# EAGLE board QuDAC_V2 (EAGLE 6.6.0), part 1 of 2
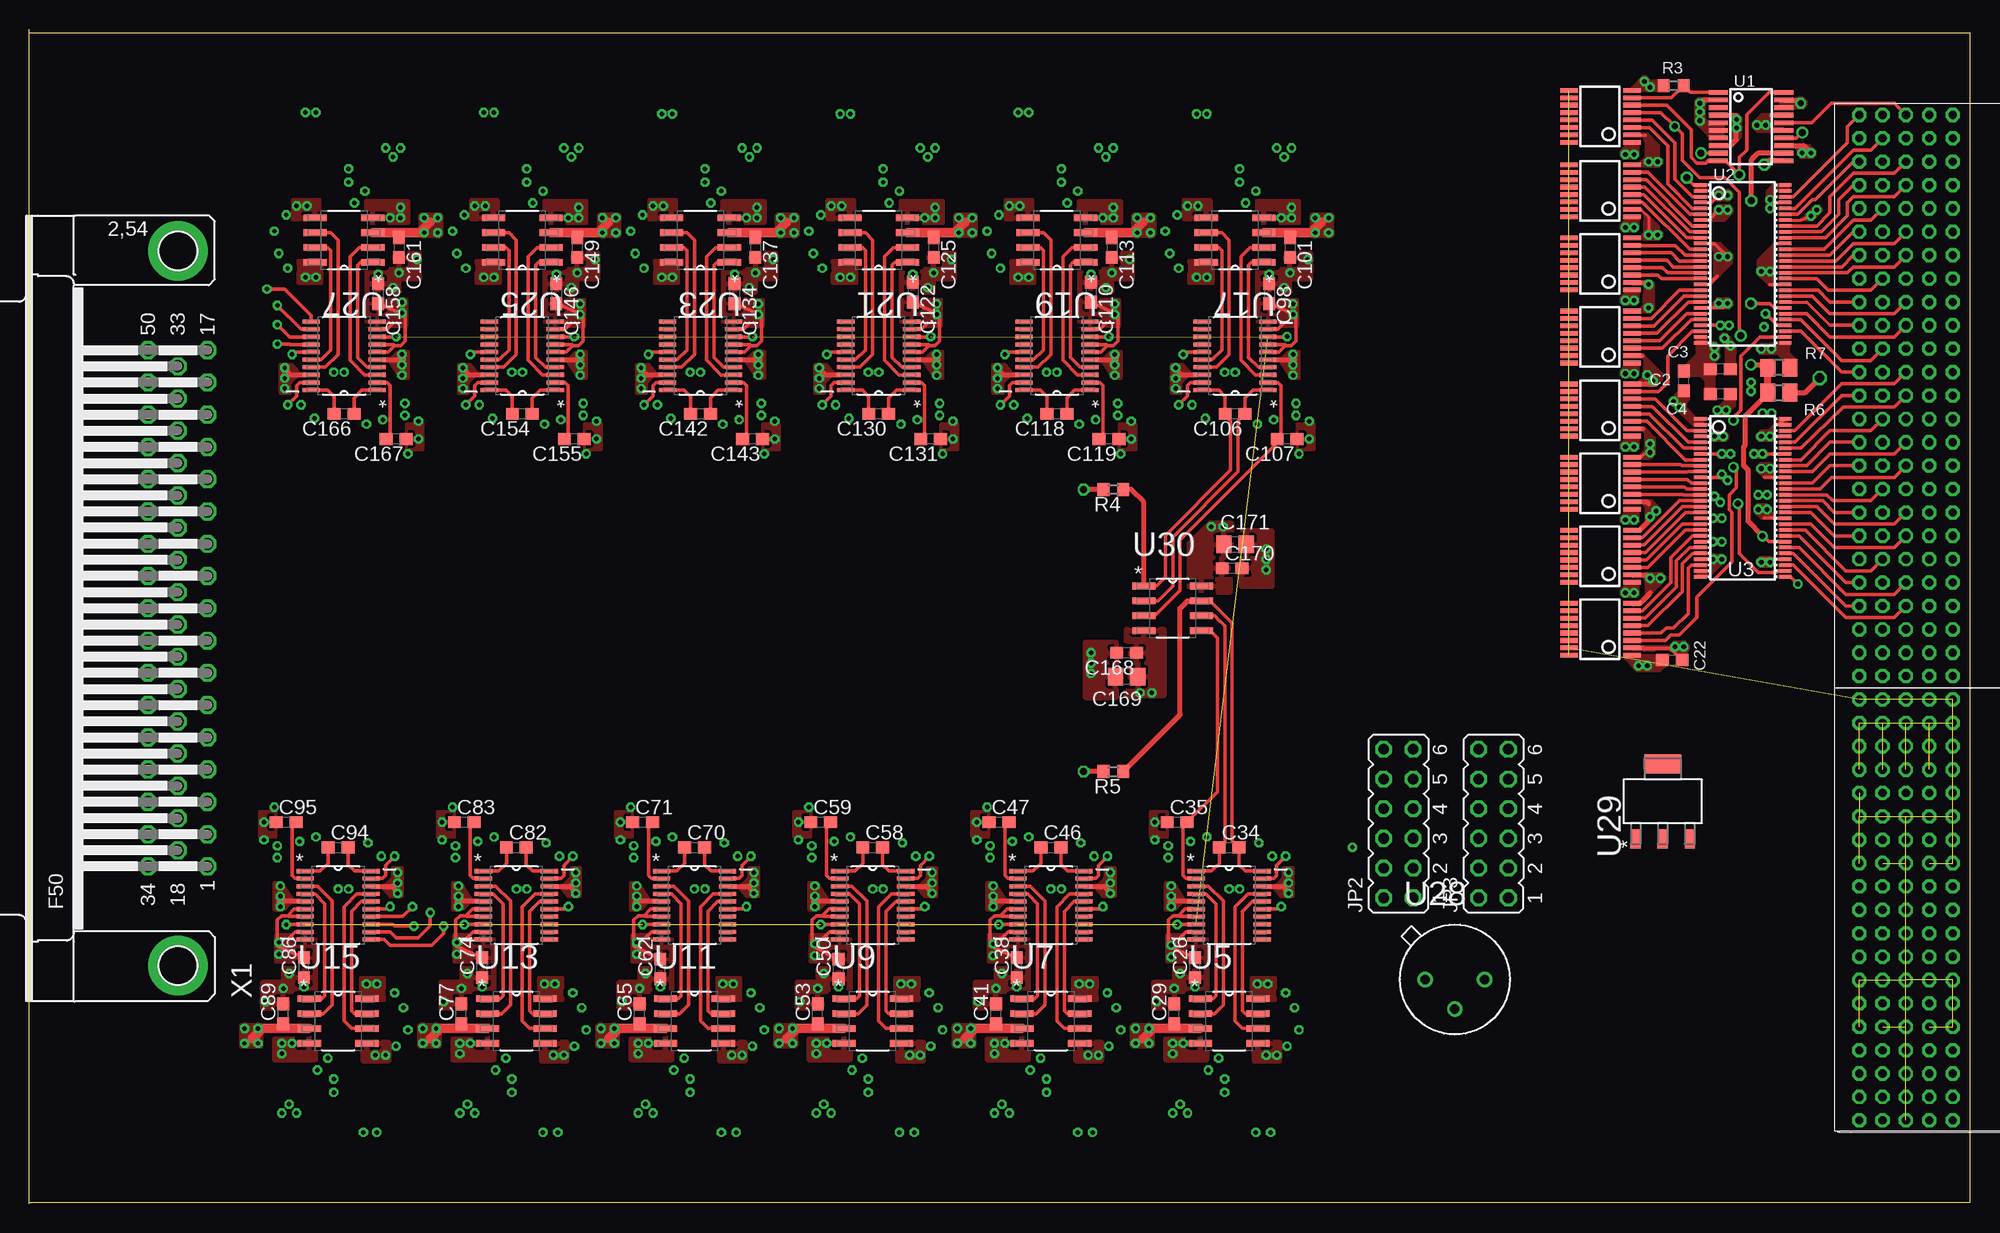
[diagram p15: board, top side]
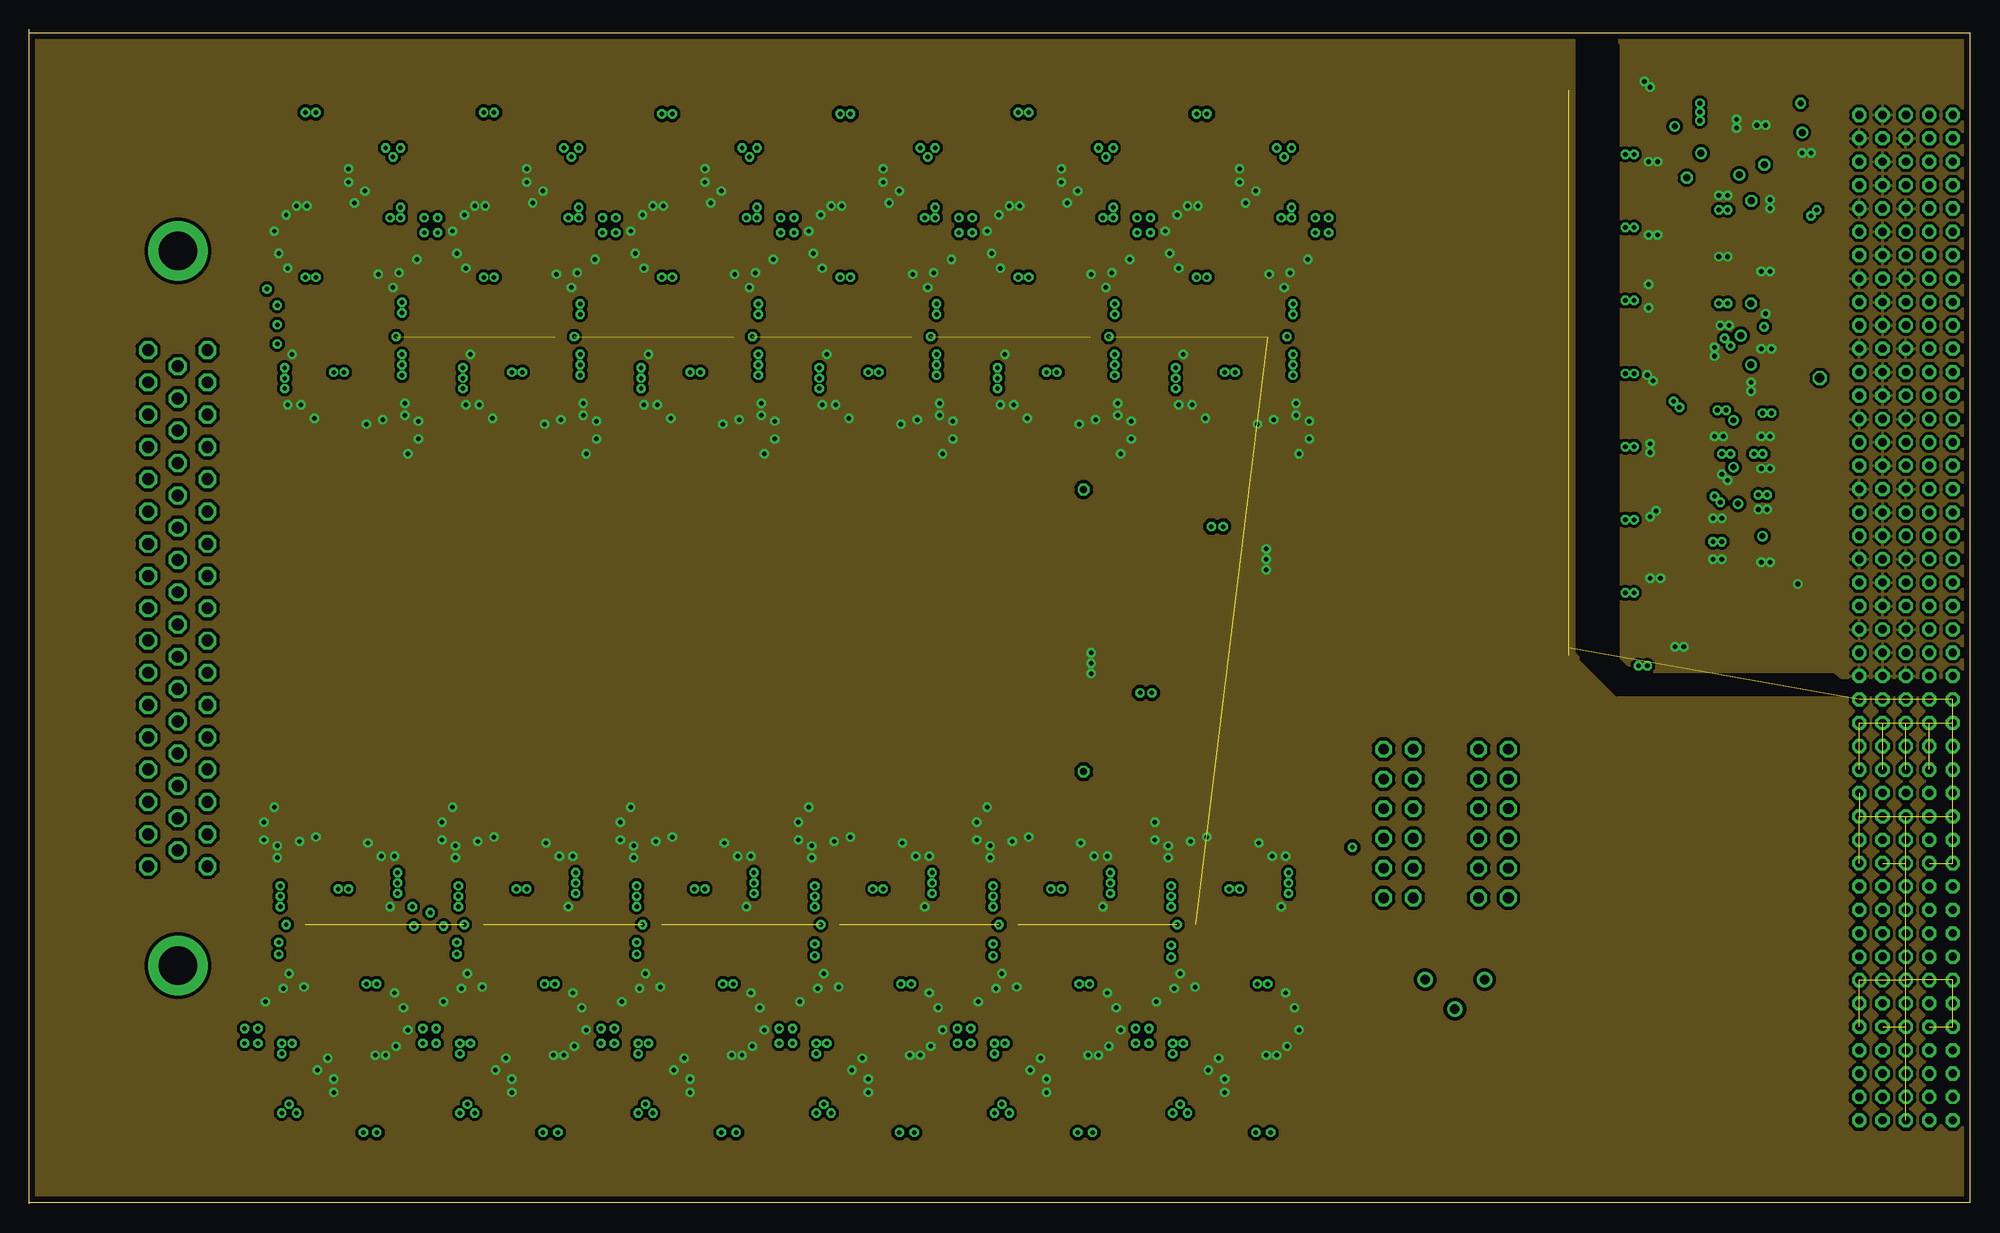
[diagram p16: board, inner layer Route2]
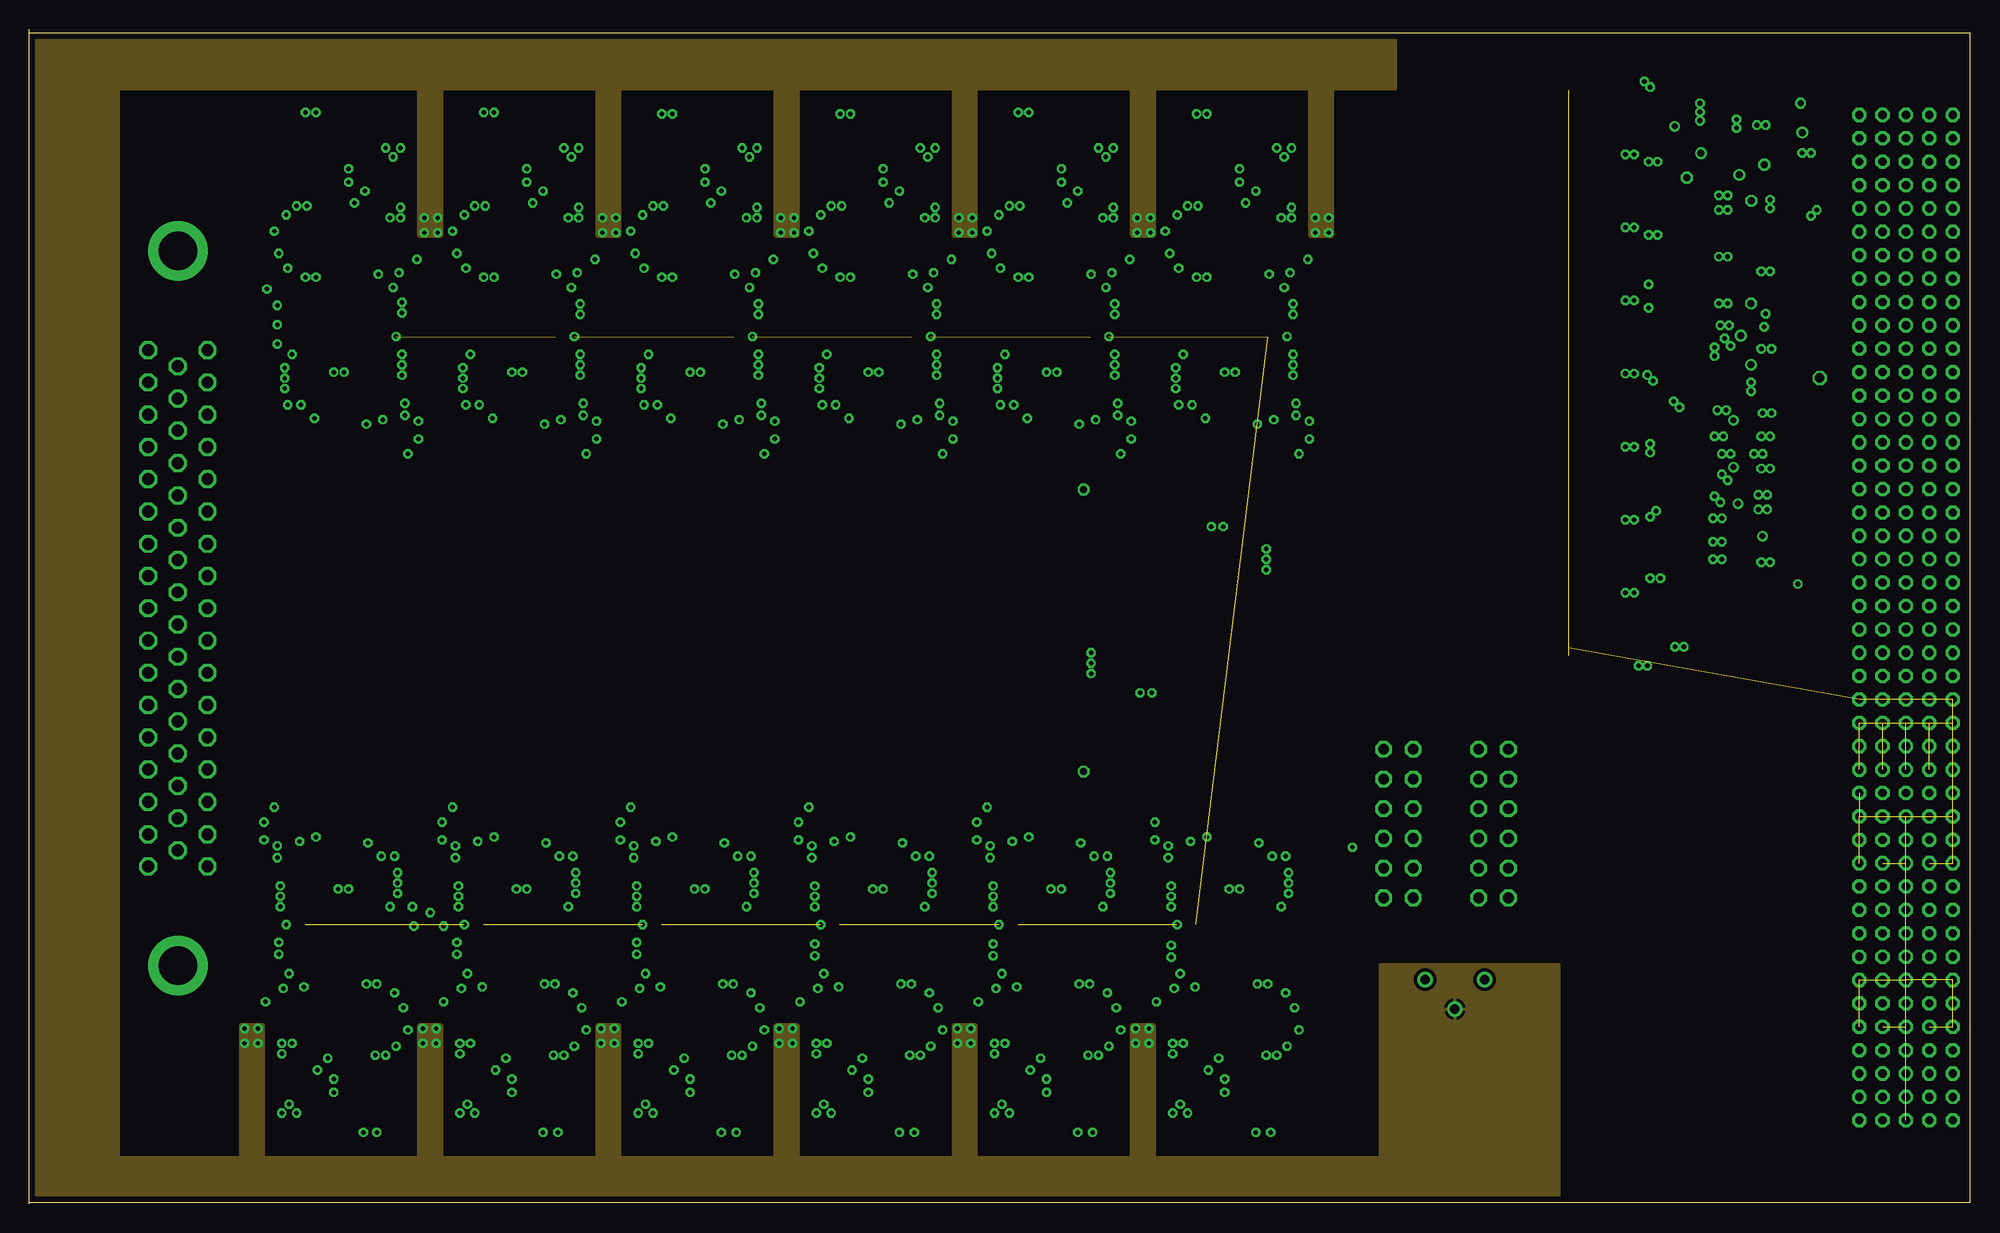
[diagram p17: board, inner layer Route3]
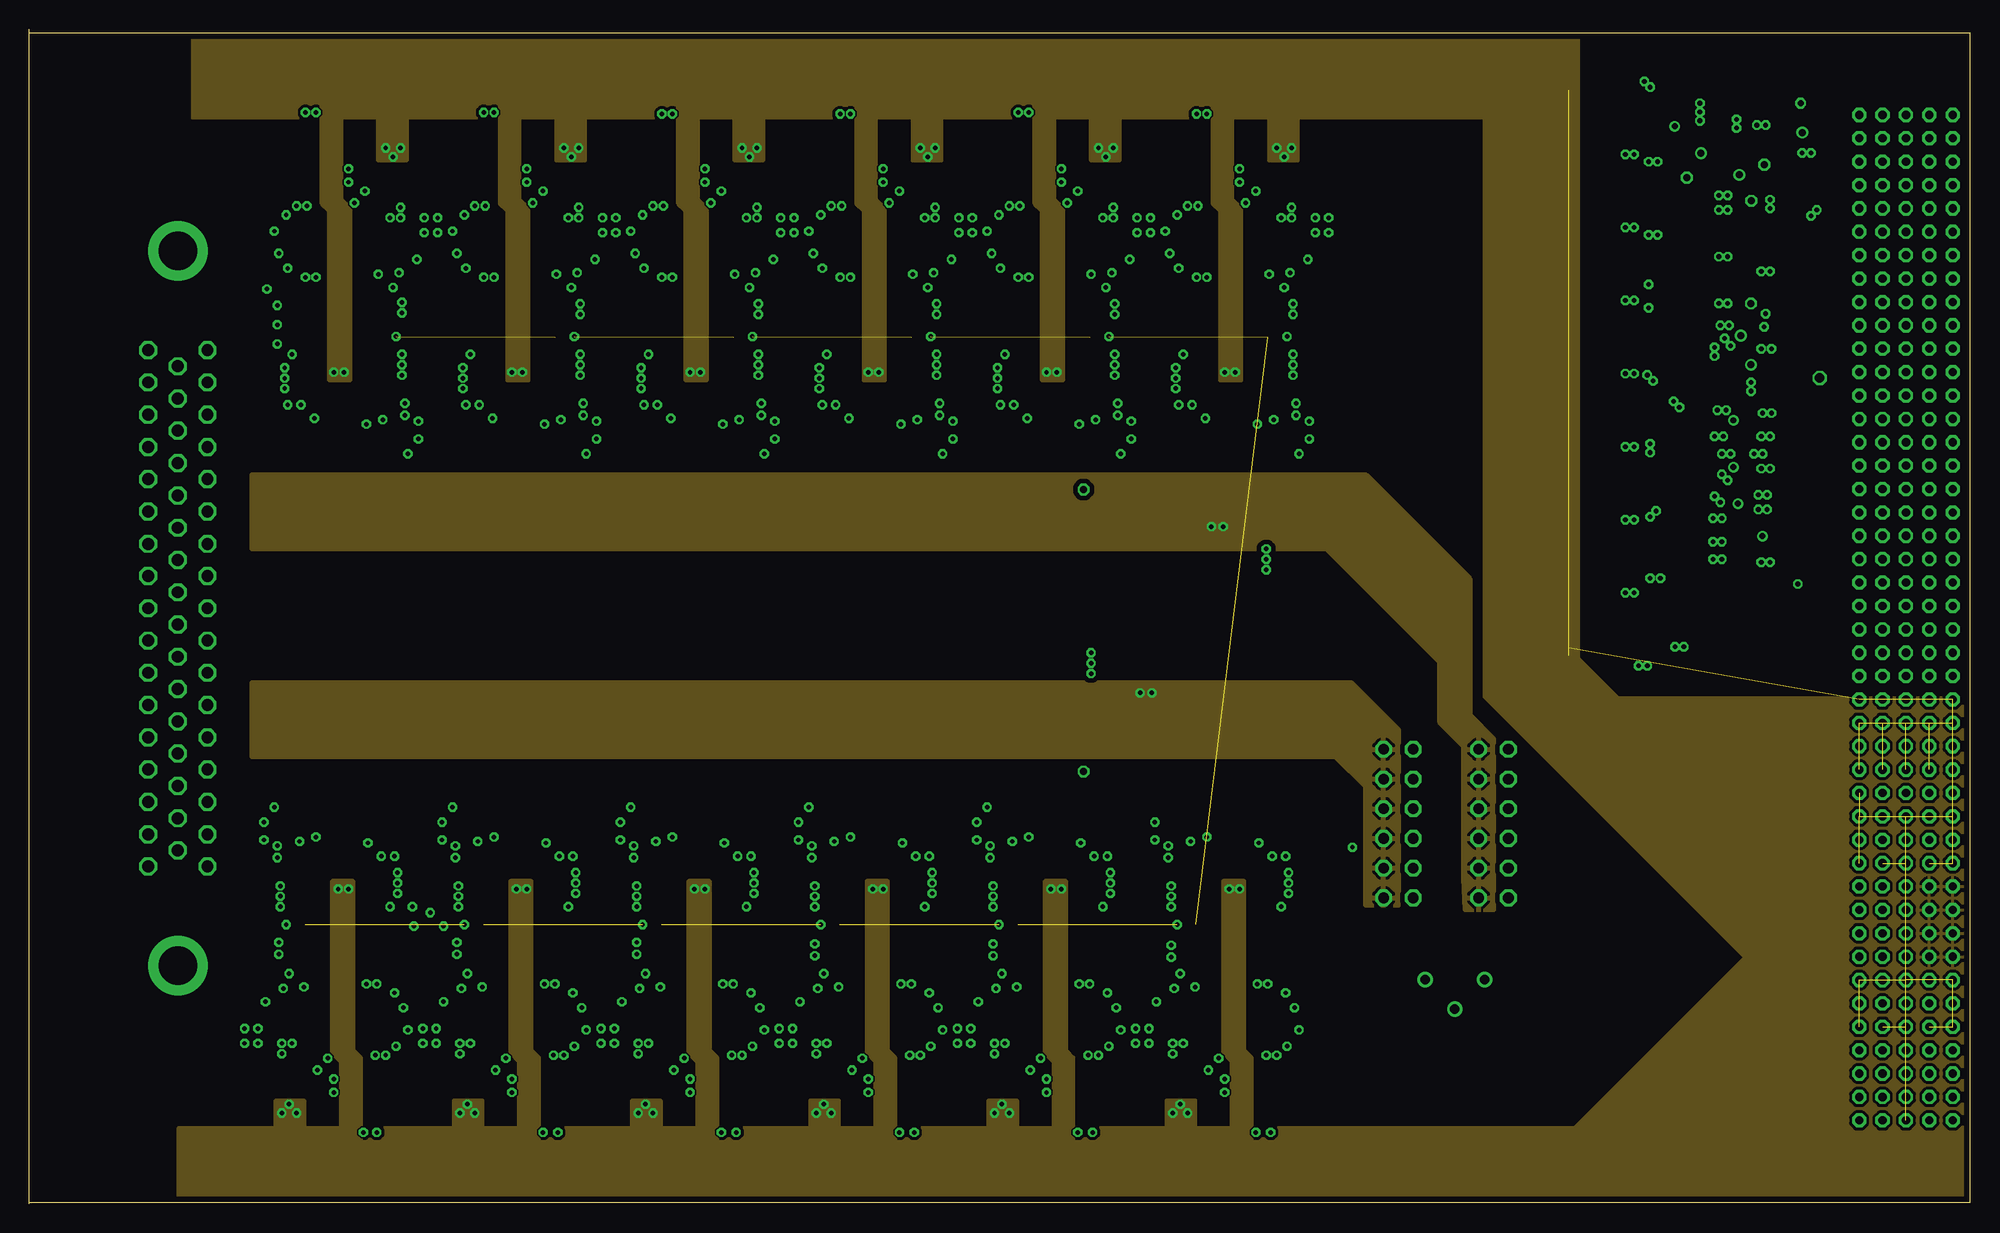
[diagram p18: board, inner layer Route14]
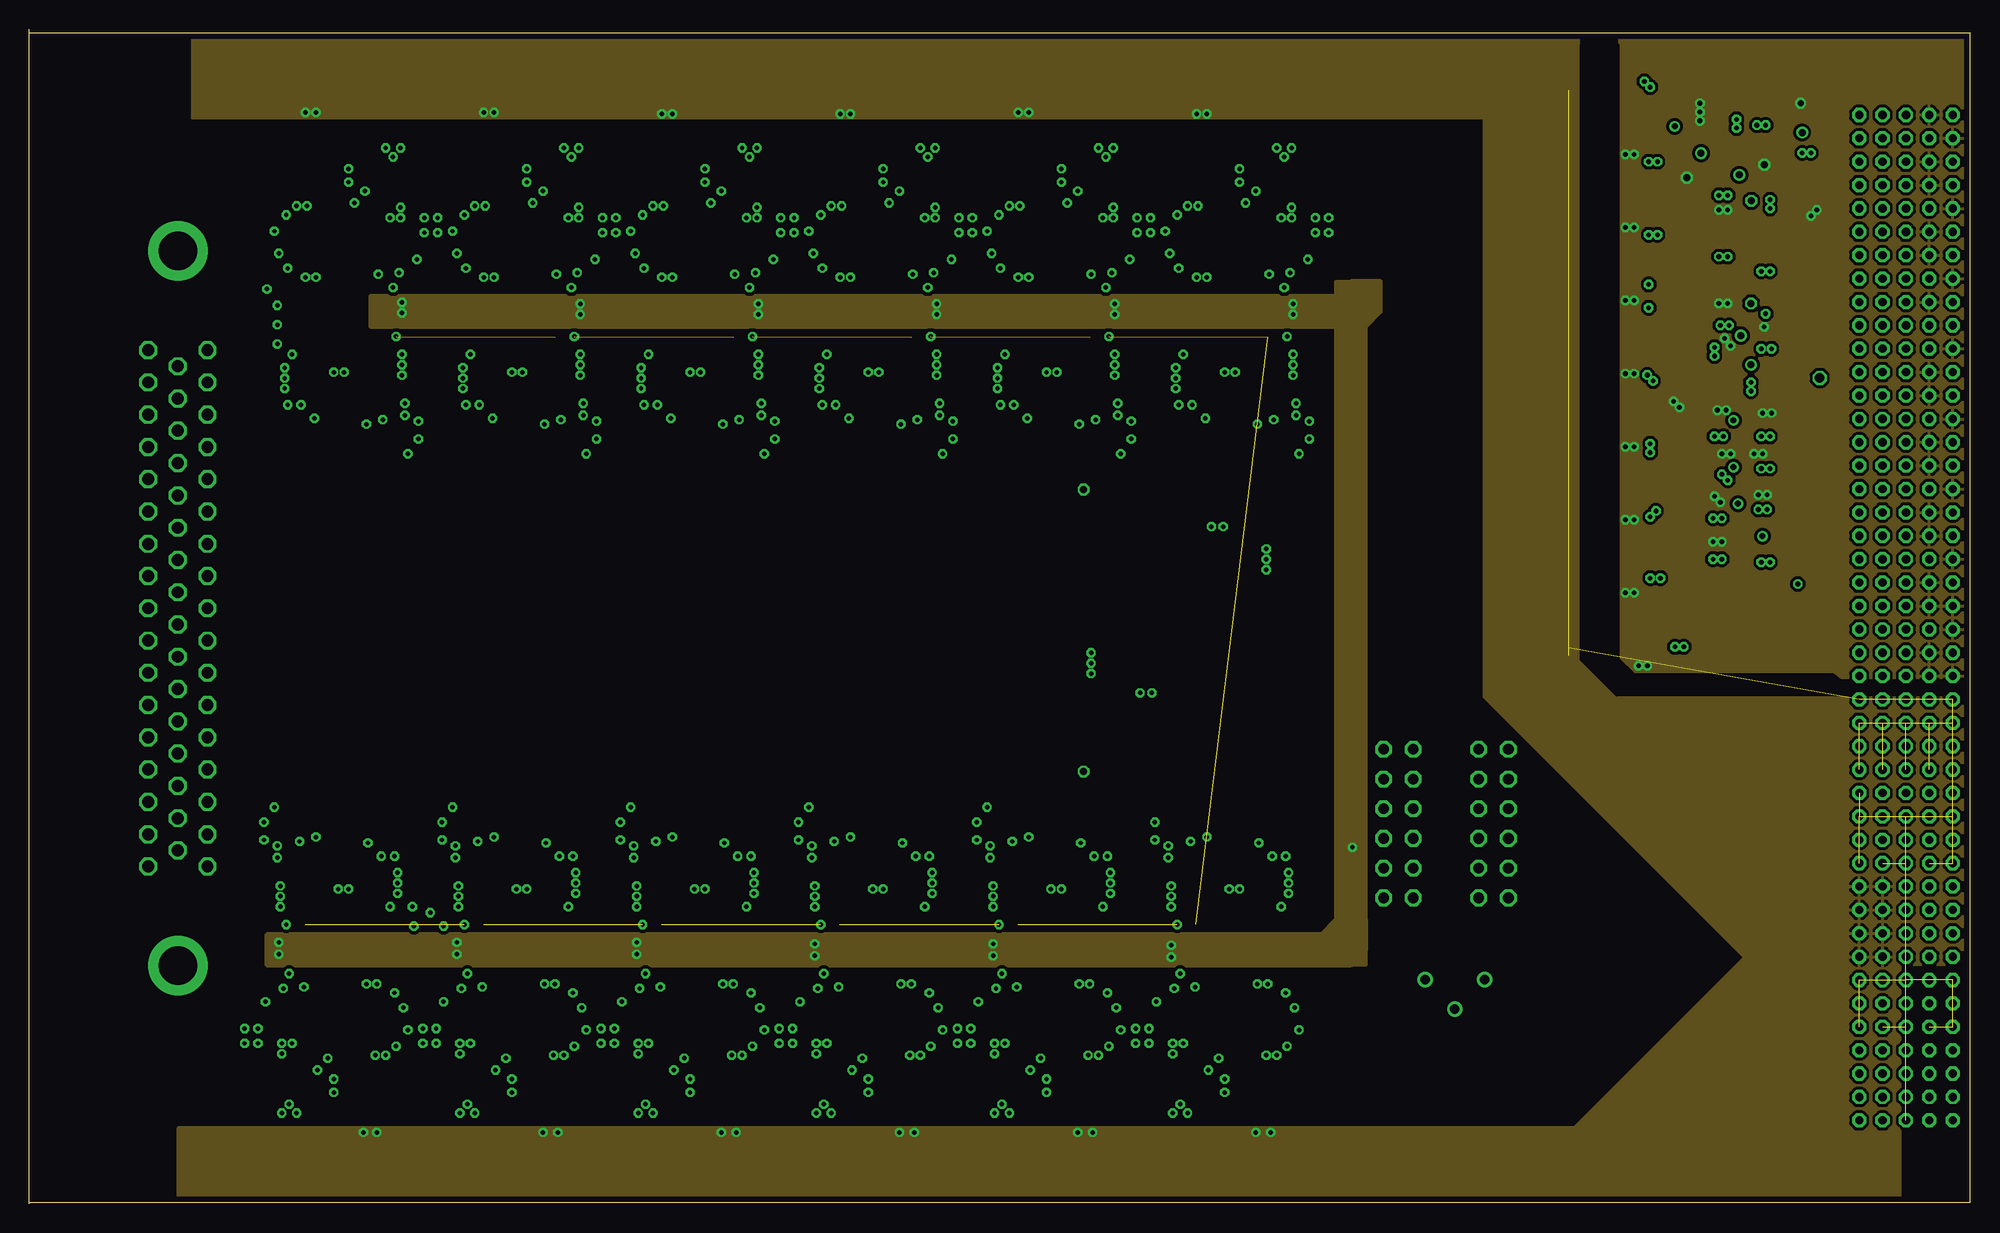
[diagram p19: board, inner layer Route15]
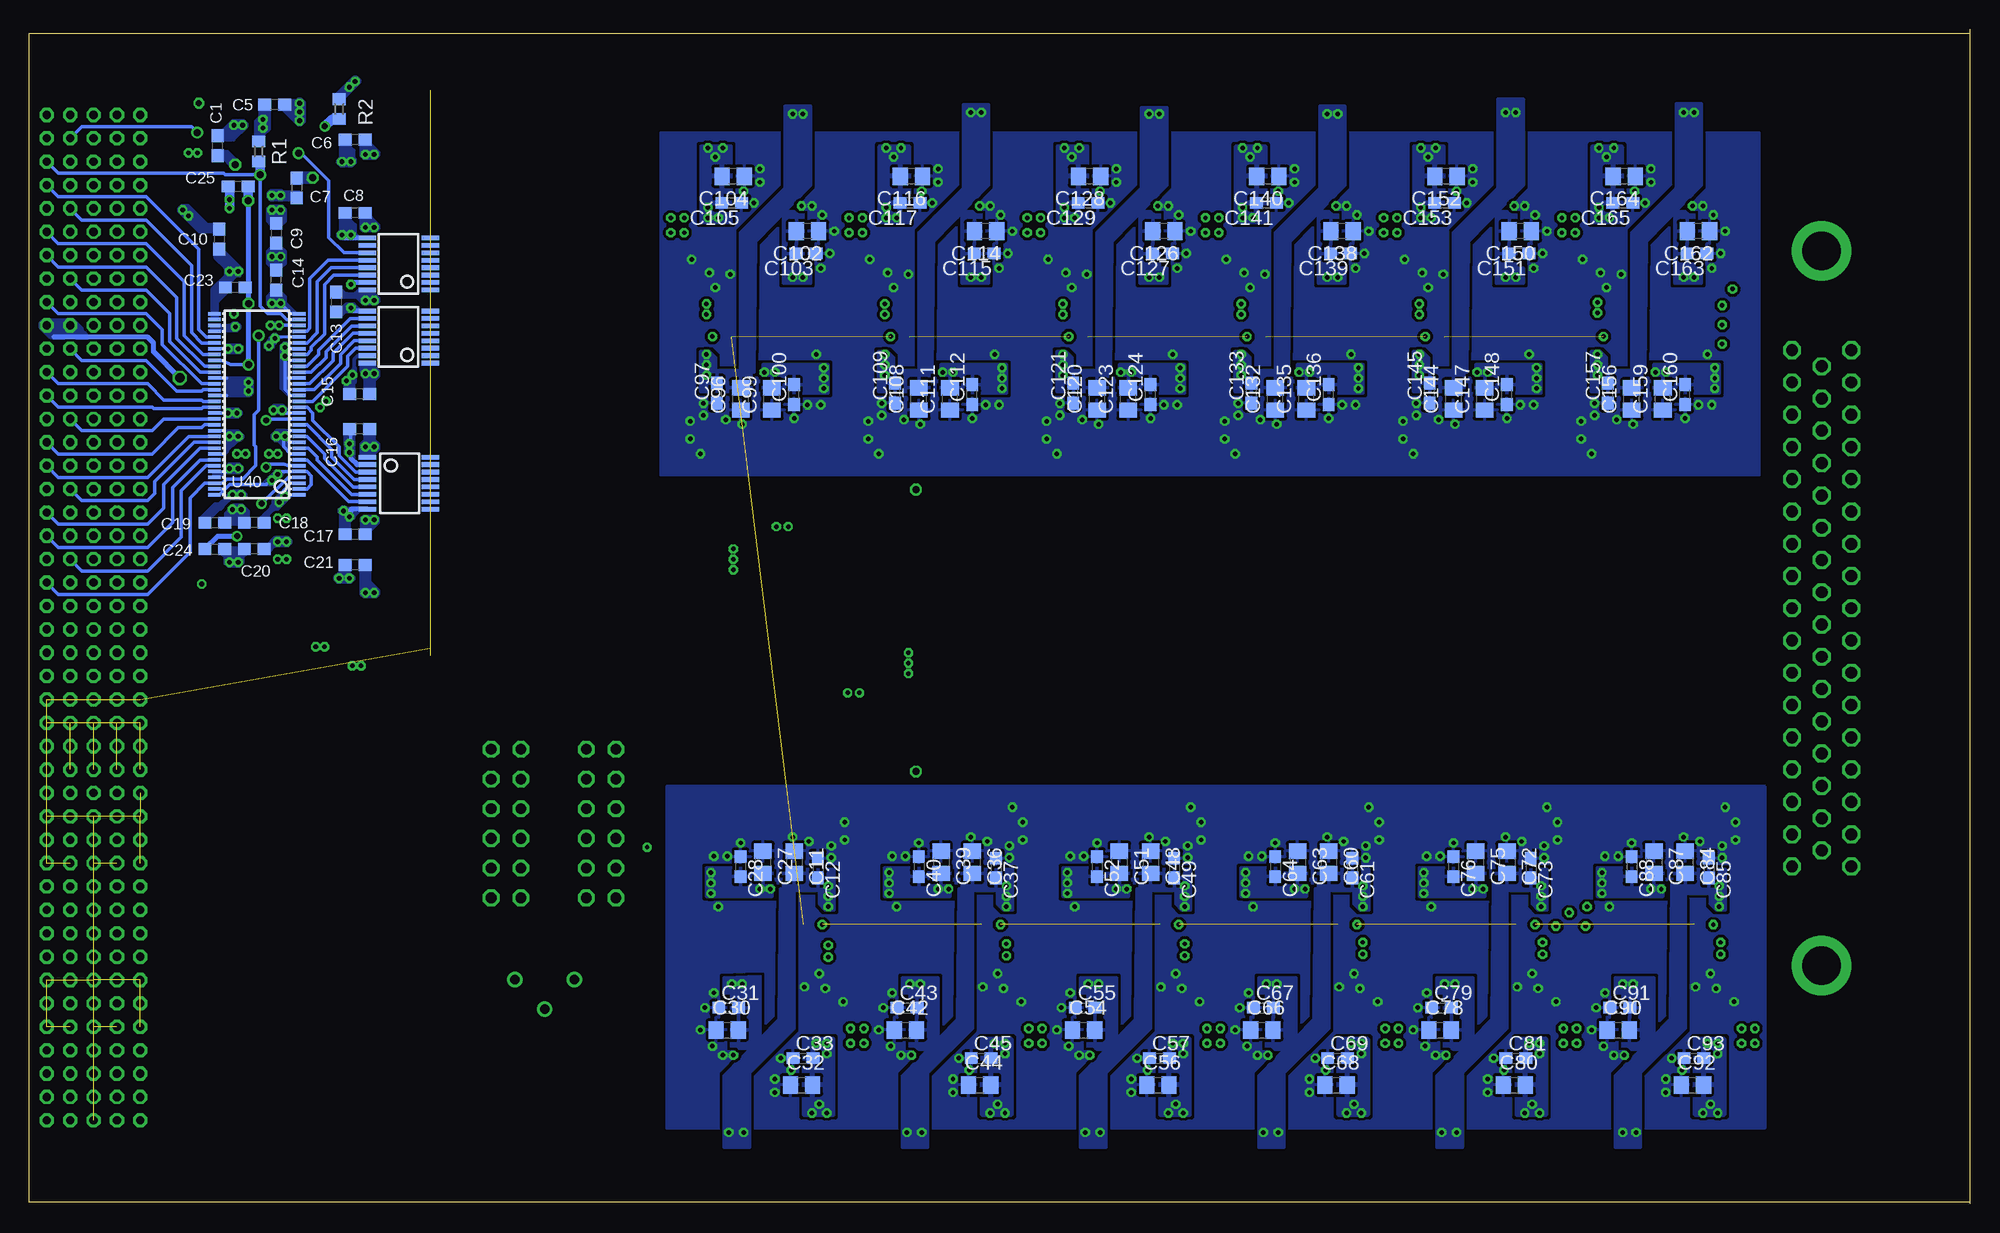
[diagram p20: board, bottom side, seen from below]

Size 166 x 100.46 mm. Coordinates in mm from the lower left corner, seen from the top.
Outline: 0,0 0,100.46
Copper layers (1*2*3*14*15*16): Top 0.035mm / dielectric 1.5mm / Route2 0.035mm / dielectric 0.15mm / Route3 0.035mm / dielectric 0.2mm / Route14 0.035mm / dielectric 0.15mm / Route15 0.035mm / dielectric 0.2mm / Bottom 0.035mm
Design rules "default *": minimum track width 10mil, minimum drill 24mil, track to track 6mil, track to pad 6mil, pad to pad 6mil, via to via 6mil, smd to smd 6mil, copper to edge 20mil, drill to drill 8mil, minimum pad ring 10mil, minimum via ring 8mil, stop-mask expansion 4mil, vias tented up to drill 0mil, thermal gap 10mil
tKeepout: area 132.8,46.5 to 135.9,97.1; area 132.8,43.6 to 137.2,46.6; area 154.2,43.4 to 166,44.9; area 135.6,43.4 to 154.2,45.4
bKeepout: area 132.8,46.5 to 135.9,95.1; area 132.8,43.6 to 137.2,46.6; area 154.2,43.4 to 166,44.9

## Footprints (pad centres in the part's own frame; a part is rotated, then mirrored left to right if it is on the bottom)
C0603 = smd 1.1 x 1: 1 -0.85,0; 2 0.85,0
C0805 = smd 1.3 x 1.5: 1 -0.95,0; 2 0.95,0
QSOP-16 = smd 0.4 x 1.5: 1 -2.223,-2.7; 2 -1.587,-2.7; 3 -0.953,-2.7; 4 -0.318,-2.7; 5 0.318,-2.7; 6 0.953,-2.7; 7 1.587,-2.7; 8 2.223,-2.7; 9 2.223,2.7; 10 1.587,2.7; 11 0.953,2.7; 12 0.318,2.7; 13 -0.318,2.7; 14 -0.953,2.7; 15 -1.587,2.7; 16 -2.223,2.7
EUROCARD-CPCI-B19+1B25-NOFRONTDIM = drill 0.7 pad 1.016 octagon: A1 78.5,43; A2 78.5,41; A3 78.5,39; A4 78.5,37; A5 78.5,35; A6 78.5,33; A7 78.5,31; A8 78.5,29; A9 78.5,27; A10 78.5,25; A11 78.5,23; A12 78.5,21; A13 78.5,19; A14 78.5,17; A15 78.5,15; A16 78.5,13; A17 78.5,11; A18 78.5,9; A19 78.5,7; A20 78.5,5; A21 78.5,3; A22 78.5,1; A23 78.5,-1; A24 78.5,-3; A25 78.5,-5; A26 78.5,-7; A27 78.5,-9; A28 78.5,-11; A29 78.5,-13; A30 78.5,-15; A31 78.5,-17; A32 78.5,-19; A33 78.5,-21; A34 78.5,-23; A35 78.5,-25; A36 78.5,-27; A37 78.5,-29; A38 78.5,-31; A39 78.5,-33; A40 78.5,-35; A41 78.5,-37; A42 78.5,-39; A43 78.5,-41; A44 78.5,-43; B1 76.5,43; B2 76.5,41; B3 76.5,39; B4 76.5,37; B5 76.5,35; B6 76.5,33; B7 76.5,31; B8 76.5,29; B9 76.5,27; B10 76.5,25; B11 76.5,23; B12 76.5,21; B13 76.5,19; B14 76.5,17; B15 76.5,15; B16 76.5,13; B17 76.5,11; B18 76.5,9; B19 76.5,7; B20 76.5,5; B21 76.5,3; B22 76.5,1; B23 76.5,-1; B24 76.5,-3; B25 76.5,-5; B26 76.5,-7; B27 76.5,-9; B28 76.5,-11; B29 76.5,-13; B30 76.5,-15; B31 76.5,-17; B32 76.5,-19; B33 76.5,-21; B34 76.5,-23; B35 76.5,-25; B36 76.5,-27; B37 76.5,-29; B38 76.5,-31; B39 76.5,-33; B40 76.5,-35; B41 76.5,-37; B42 76.5,-39; B43 76.5,-41; B44 76.5,-43; C1 74.5,43; C2 74.5,41; C3 74.5,39; C4 74.5,37; C5 74.5,35; C6 74.5,33; C7 74.5,31; C8 74.5,29; C9 74.5,27; C10 74.5,25; C11 74.5,23; C12 74.5,21; C13 74.5,19; C14 74.5,17; C15 74.5,15; C16 74.5,13; C17 74.5,11; C18 74.5,9; C19 74.5,7; C20 74.5,5; C21 74.5,3; C22 74.5,1; C23 74.5,-1; C24 74.5,-3; C25 74.5,-5; C26 74.5,-7; C27 74.5,-9; C28 74.5,-11; C29 74.5,-13; C30 74.5,-15; C31 74.5,-17; C32 74.5,-19; C33 74.5,-21; C34 74.5,-23; C35 74.5,-25; C36 74.5,-27; C37 74.5,-29; C38 74.5,-31; C39 74.5,-33; C40 74.5,-35; C41 74.5,-37; C42 74.5,-39; C43 74.5,-41; C44 74.5,-43; D1 72.5,43; D2 72.5,41; D3 72.5,39; D4 72.5,37; D5 72.5,35; D6 72.5,33; D7 72.5,31; D8 72.5,29; D9 72.5,27; D10 72.5,25; D11 72.5,23; D12 72.5,21; D13 72.5,19; D14 72.5,17; D15 72.5,15; D16 72.5,13; D17 72.5,11; D18 72.5,9; D19 72.5,7; D20 72.5,5; D21 72.5,3; D22 72.5,1; D23 72.5,-1; D24 72.5,-3; D25 72.5,-5; D26 72.5,-7; D27 72.5,-9; D28 72.5,-11; D29 72.5,-13; D30 72.5,-15; D31 72.5,-17; D32 72.5,-19; D33 72.5,-21; D34 72.5,-23; D35 72.5,-25; D36 72.5,-27; D37 72.5,-29; D38 72.5,-31; D39 72.5,-33; D40 72.5,-35; D41 72.5,-37; D42 72.5,-39; D43 72.5,-41; D44 72.5,-43; E1 70.5,43; E2 70.5,41; E3 70.5,39; E4 70.5,37; E5 70.5,35; E6 70.5,33; E7 70.5,31; E8 70.5,29; E9 70.5,27; E10 70.5,25; E11 70.5,23; E12 70.5,21; E13 70.5,19; E14 70.5,17; E15 70.5,15; E16 70.5,13; E17 70.5,11; E18 70.5,9; E19 70.5,7; E20 70.5,5; E21 70.5,3; E22 70.5,1; E23 70.5,-1; E24 70.5,-3; E25 70.5,-5; E26 70.5,-7; E27 70.5,-9; E28 70.5,-11; E29 70.5,-13; E30 70.5,-15; E31 70.5,-17; E32 70.5,-19; E33 70.5,-21; E34 70.5,-23; E35 70.5,-25; E36 70.5,-27; E37 70.5,-29; E38 70.5,-31; E39 70.5,-33; E40 70.5,-35; E41 70.5,-37; E42 70.5,-39; E43 70.5,-41; E44 70.5,-43
JP6Q = drill 0.914 octagon: 1 -6.35,-1.27; 2 -6.35,1.27; 3 -3.81,-1.27; 4 -3.81,1.27; 5 -1.27,-1.27; 6 -1.27,1.27; 7 1.27,-1.27; 8 1.27,1.27; 9 3.81,-1.27; 10 3.81,1.27; 11 6.35,-1.27; 12 6.35,1.27
R0603 = smd 1 x 1.1: 1 -0.85,0; 2 0.85,0
R0805 = smd 1.3 x 1.5: 1 -0.95,0; 2 0.95,0
TSSOP-20 = smd 0.4 x 1.6: 1 -2.925,-2.8; 2 -2.275,-2.8; 3 -1.625,-2.8; 4 -0.975,-2.8; 5 -0.325,-2.8; 6 0.325,-2.8; 7 0.975,-2.8; 8 1.625,-2.8; 9 2.275,-2.8; 10 2.925,-2.8; 11 2.925,2.8; 12 2.275,2.8; 13 1.625,2.8; 14 0.975,2.8; 15 0.325,2.8; 16 -0.325,2.8; 17 -0.975,2.8; 18 -1.625,2.8; 19 -2.275,2.8; 20 -2.925,2.8
TSSOP-56 = smd 0.3 x 1.1: 1 -7,0.4; 2 -6.5,0.4; 3 -6,0.4; 4 -5.5,0.4; 5 -5,0.4; 6 -4.5,0.4; 7 -4,0.4; 8 -3.5,0.4; 9 -3,0.4; 10 -2.5,0.4; 11 -2,0.4; 12 -1.5,0.4; 13 -1,0.4; 14 -0.5,0.4; 15 0,0.4; 16 0.5,0.4; 17 1,0.4; 18 1.5,0.4; 19 2,0.4; 20 2.5,0.4; 21 3,0.4; 22 3.5,0.4; 23 4,0.4; 24 4.5,0.4; 25 5,0.4; 26 5.5,0.4; 27 6,0.4; 28 6.5,0.4; 29 6.5,7.66; 30 6,7.66; 31 5.5,7.66; 32 5,7.66; 33 4.5,7.66; 34 4,7.66; 35 3.5,7.66; 36 3,7.66; 37 2.5,7.66; 38 2,7.66; 39 1.5,7.66; 40 1,7.66; 41 0.5,7.66; 42 0,7.66; 43 -0.5,7.66; 44 -1,7.66; 45 -1.5,7.66; 46 -2,7.66; 47 -2.5,7.66; 48 -3,7.66; 49 -3.5,7.66; 50 -4,7.66; 51 -4.5,7.66; 52 -5,7.66; 53 -5.5,7.66; 54 -6,7.66; 55 -6.5,7.66; 56 -7,7.66
SOP65P640X120-20N = smd 1.473 x 0.356: 1 -2.819,2.921; 2 -2.819,2.286; 3 -2.819,1.626; 4 -2.819,0.965; 5 -2.819,0.33; 6 -2.819,-0.33; 7 -2.819,-0.965; 8 -2.819,-1.626; 9 -2.819,-2.286; 10 -2.819,-2.921; 11 2.819,-2.921; 12 2.819,-2.286; 13 2.819,-1.626; 14 2.819,-0.965; 15 2.819,-0.33; 16 2.819,0.33; 17 2.819,0.965; 18 2.819,1.626; 19 2.819,2.286; 20 2.819,2.921
SOIC127P600X175-8N = smd 1.981 x 0.559: 1 -2.464,1.905; 2 -2.464,0.635; 3 -2.464,-0.635; 4 -2.464,-1.905; 5 2.464,-1.905; 6 2.464,-0.635; 7 2.464,0.635; 8 2.464,1.905
TO254P939X470-3P = drill 0.813: 1 -5.08,0; 2 -2.54,-2.54; 3 0,0
SOT230P700X180-4N = smd 1.626 x 0.889: 1 -3.2,2.311; 2 -3.2,0; 3 -3.2,-2.311 | smd 1.626 x 3.175: 4 3.2,0
TSSOP-64 = smd 0.3 x 1.1: 1 -7.5,0.4; 2 -7,0.4; 3 -6.5,0.4; 4 -6,0.4; 5 -5.5,0.4; 6 -5,0.4; 7 -4.5,0.4; 8 -4,0.4; 9 -3.5,0.4; 10 -3,0.4; 11 -2.5,0.4; 12 -2,0.4; 13 -1.5,0.4; 14 -1,0.4; 15 -0.5,0.4; 16 0,0.4; 17 0.5,0.4; 18 1,0.4; 19 1.5,0.4; 20 2,0.4; 21 2.5,0.4; 22 3,0.4; 23 3.5,0.4; 24 4,0.4; 25 4.5,0.4; 26 5,0.4; 27 5.5,0.4; 28 6,0.4; 29 6.5,0.4; 30 7,0.4; 31 7.5,0.4; 32 8,0.4; 33 8,7.66; 34 7.5,7.66; 35 7,7.66; 36 6.5,7.66; 37 6,7.66; 38 5.5,7.66; 39 5,7.66; 40 4.5,7.66; 41 4,7.66; 42 3.5,7.66; 43 3,7.66; 44 2.5,7.66; 45 2,7.66; 46 1.5,7.66; 47 1,7.66; 48 0.5,7.66; 49 0,7.66; 50 -0.5,7.66; 51 -1,7.66; 52 -1.5,7.66; 53 -2,7.66; 54 -2.5,7.66; 55 -3,7.66; 56 -3.5,7.66; 57 -4,7.66; 58 -4.5,7.66; 59 -5,7.66; 60 -5.5,7.66; 61 -6,7.66; 62 -6.5,7.66; 63 -7,7.66; 64 -7.5,7.66
F50HP = drill 1.016 octagon: 1 -22.073,-2.54; 2 -19.329,-2.54; 3 -16.561,-2.54; 4 -13.792,-2.54; 5 -11.049,-2.54; 6 -8.28,-2.54; 7 -5.512,-2.54; 8 -2.769,-2.54; 9 0,-2.54; 10 2.769,-2.54; 11 5.512,-2.54; 12 8.28,-2.54; 13 11.049,-2.54; 14 13.792,-2.54; 15 16.561,-2.54; 16 19.329,-2.54; 17 22.073,-2.54; 18 -20.701,0; 19 -17.958,0; 20 -15.189,0; 21 -12.421,0; 22 -9.677,0; 23 -6.909,0; 24 -4.14,0; 25 -1.397,0; 26 1.372,0; 27 4.14,0; 28 6.883,0; 29 9.652,0; 30 12.421,0; 31 15.189,0; 32 17.932,0; 33 20.701,0; 34 -22.073,2.54; 35 -19.329,2.54; 36 -16.561,2.54; 37 -13.792,2.54; 38 -11.049,2.54; 39 -8.28,2.54; 40 -5.512,2.54; 41 -2.769,2.54; 42 0,2.54; 43 2.769,2.54; 44 5.512,2.54; 45 8.28,2.54; 46 11.049,2.54; 47 13.792,2.54; 48 16.561,2.54; 49 19.329,2.54; 50 22.073,2.54 | drill 3.302 pad 5.08: G1 -30.556,0; G2 30.556,0

## Placement (x,y rotation side)
C1  [C0603]  149.88,90.5 90 bottom
C2  [C0603]  141.5,70.38 90 top
C3  [C0603]  144.62,71.38 180 top
C4  [C0603]  144.62,69.25 180 top
C5  [C0603]  145,94 180 bottom
C6  [C0603]  138.12,91 180 bottom
C7  [C0603]  143.12,86.88 270 bottom
C8  [C0603]  138.12,84.75 180 bottom
C9  [C0603]  144.88,83 270 bottom
C10  [C0603]  149.75,82.5 270 bottom
C11  10uF  [C0805]  100.59,29.21 270 bottom
C12  0.1uF  [C0603]  98.55,28.7 270 bottom
C13  [C0603]  139.75,77.13 270 bottom
C14  [C0603]  144.88,79 90 bottom
C15  [C0603]  137.75,69.25 180 bottom
C16  [C0603]  137.75,66.25 180 bottom
C17  [C0603]  138.12,57.25 180 bottom
C18  [C0603]  146.75,58.25 180 bottom
C19  [C0603]  150.12,58.25 0 bottom
C20  [C0603]  146.75,56 180 bottom
C21  [C0603]  138.12,54.63 180 bottom
C22  [C0603]  140.5,46.5 0 top
C23  .1uF  [C0603]  148.38,78.38 180 bottom
C24  .1uF  [C0603]  150.12,56 0 bottom
C25  .1uF  [C0603]  148.12,87 180 bottom
C26  [C0603]  99.7,20.19 90 top
C27  10uF  [C0805]  103.25,29.21 270 bottom
C28  0.1uF  [C0603]  105.16,28.83 270 bottom
C29  0.1uF  [C0603]  97.92,16.26 90 top
C30  10uF  [C0805]  106.3,14.86 0 bottom
C31  0.1uF  [C0603]  106.17,16.76 0 bottom
C32  10uF  [C0805]  99.95,10.16 0 bottom
C33  0.1uF  [C0603]  99.82,12.45 0 bottom
C34  10pF  [C0603]  102.62,30.48 0 top
C35  50pF  [C0603]  98.17,32.64 0 top
C36  10uF  [C0805]  85.35,29.21 270 bottom
C37  0.1uF  [C0603]  83.31,28.7 270 bottom
C38  [C0603]  84.46,20.19 90 top
C39  10uF  [C0805]  88.01,29.21 270 bottom
C40  0.1uF  [C0603]  89.92,28.83 270 bottom
C41  0.1uF  [C0603]  82.68,16.26 90 top
C42  10uF  [C0805]  91.06,14.86 0 bottom
C43  0.1uF  [C0603]  90.93,16.76 0 bottom
C44  10uF  [C0805]  84.71,10.16 0 bottom
C45  0.1uF  [C0603]  84.58,12.45 0 bottom
C46  10pF  [C0603]  87.38,30.48 0 top
C47  50pF  [C0603]  82.93,32.64 0 top
C48  10uF  [C0805]  70.11,29.21 270 bottom
C49  0.1uF  [C0603]  68.07,28.7 270 bottom
C50  [C0603]  69.22,20.07 90 top
C51  10uF  [C0805]  72.77,29.21 270 bottom
C52  0.1uF  [C0603]  74.68,28.83 270 bottom
C53  0.1uF  [C0603]  67.44,16.26 90 top
C54  10uF  [C0805]  75.82,14.86 0 bottom
C55  0.1uF  [C0603]  75.69,16.76 0 bottom
C56  10uF  [C0805]  69.47,10.16 0 bottom
C57  0.1uF  [C0603]  69.34,12.45 0 bottom
C58  10pF  [C0603]  72.14,30.48 0 top
C59  50pF  [C0603]  67.69,32.64 0 top
C60  10uF  [C0805]  54.87,29.21 270 bottom
C61  0.1uF  [C0603]  52.83,28.7 270 bottom
C62  [C0603]  53.98,20.07 90 top
C63  10uF  [C0805]  57.53,29.21 270 bottom
C64  0.1uF  [C0603]  59.44,28.83 270 bottom
C65  0.1uF  [C0603]  52.2,16.26 90 top
C66  10uF  [C0805]  60.58,14.86 0 bottom
C67  0.1uF  [C0603]  60.45,16.76 0 bottom
C68  10uF  [C0805]  54.23,10.16 0 bottom
C69  0.1uF  [C0603]  54.1,12.45 0 bottom
C70  10pF  [C0603]  56.9,30.48 0 top
C71  50pF  [C0603]  52.45,32.64 0 top
C72  10uF  [C0805]  39.63,29.21 270 bottom
C73  0.1uF  [C0603]  37.59,28.7 270 bottom
C74  [C0603]  38.74,20.19 90 top
C75  10uF  [C0805]  42.29,29.21 270 bottom
C76  0.1uF  [C0603]  44.2,28.83 270 bottom
C77  0.1uF  [C0603]  36.96,16.26 90 top
C78  10uF  [C0805]  45.34,14.86 0 bottom
C79  0.1uF  [C0603]  45.21,16.76 0 bottom
C80  10uF  [C0805]  38.99,10.16 0 bottom
C81  0.1uF  [C0603]  38.86,12.45 0 bottom
C82  10pF  [C0603]  41.66,30.48 0 top
C83  50pF  [C0603]  37.21,32.64 0 top
C84  10uF  [C0805]  24.39,29.21 270 bottom
C85  0.1uF  [C0603]  22.35,28.7 270 bottom
C86  [C0603]  23.5,20.19 90 top
C87  10uF  [C0805]  27.05,29.21 270 bottom
C88  0.1uF  [C0603]  28.96,28.83 270 bottom
C89  0.1uF  [C0603]  21.72,16.26 90 top
C90  10uF  [C0805]  30.1,14.86 0 bottom
C91  0.1uF  [C0603]  29.97,16.76 0 bottom
C92  10uF  [C0805]  23.75,10.16 0 bottom
C93  0.1uF  [C0603]  23.62,12.45 0 bottom
C94  10pF  [C0603]  26.42,30.48 0 top
C95  50pF  [C0603]  21.97,32.64 0 top
C96  10uF  [C0805]  105.16,68.83 90 bottom
C97  0.1uF  [C0603]  107.19,69.34 90 bottom
C98  [C0603]  106.05,77.85 270 top
C99  10uF  [C0805]  102.49,68.83 90 bottom
C100  0.1uF  [C0603]  100.59,69.21 90 bottom
C101  0.1uF  [C0603]  107.83,81.79 270 top
C102  10uF  [C0805]  99.44,83.19 180 bottom
C103  0.1uF  [C0603]  99.57,81.28 180 bottom
C104  10uF  [C0805]  105.79,87.88 180 bottom
C105  0.1uF  [C0603]  105.92,85.6 180 bottom
C106  10pF  [C0603]  103.13,67.56 180 top
C107  50pF  [C0603]  107.57,65.41 180 top
C108  10uF  [C0805]  89.92,68.83 90 bottom
C109  0.1uF  [C0603]  91.95,69.34 90 bottom
C110  [C0603]  90.81,77.98 270 top
C111  10uF  [C0805]  87.25,68.83 90 bottom
C112  0.1uF  [C0603]  85.35,69.21 90 bottom
C113  0.1uF  [C0603]  92.59,81.79 270 top
C114  10uF  [C0805]  84.2,83.19 180 bottom
C115  0.1uF  [C0603]  84.33,81.28 180 bottom
C116  10uF  [C0805]  90.55,87.88 180 bottom
C117  0.1uF  [C0603]  90.68,85.6 180 bottom
C118  10pF  [C0603]  87.89,67.56 180 top
C119  50pF  [C0603]  92.33,65.41 180 top
C120  10uF  [C0805]  74.68,68.83 90 bottom
C121  0.1uF  [C0603]  76.71,69.34 90 bottom
C122  [C0603]  75.57,77.98 270 top
C123  10uF  [C0805]  72.01,68.83 90 bottom
C124  0.1uF  [C0603]  70.11,69.21 90 bottom
C125  0.1uF  [C0603]  77.35,81.79 270 top
C126  10uF  [C0805]  68.96,83.19 180 bottom
C127  0.1uF  [C0603]  69.09,81.28 180 bottom
C128  10uF  [C0805]  75.31,87.88 180 bottom
C129  0.1uF  [C0603]  75.44,85.6 180 bottom
C130  10pF  [C0603]  72.65,67.56 180 top
C131  50pF  [C0603]  77.09,65.41 180 top
C132  10uF  [C0805]  59.44,68.83 90 bottom
C133  0.1uF  [C0603]  61.47,69.34 90 bottom
C134  [C0603]  60.33,77.85 270 top
C135  10uF  [C0805]  56.77,68.83 90 bottom
C136  0.1uF  [C0603]  54.87,69.21 90 bottom
C137  0.1uF  [C0603]  62.11,81.79 270 top
C138  10uF  [C0805]  53.72,83.19 180 bottom
C139  0.1uF  [C0603]  53.85,81.28 180 bottom
C140  10uF  [C0805]  60.07,87.88 180 bottom
C141  0.1uF  [C0603]  60.2,85.6 180 bottom
C142  10pF  [C0603]  57.41,67.56 180 top
C143  50pF  [C0603]  61.85,65.41 180 top
C144  10uF  [C0805]  44.2,68.83 90 bottom
C145  0.1uF  [C0603]  46.23,69.34 90 bottom
C146  [C0603]  45.09,77.85 270 top
C147  10uF  [C0805]  41.53,68.83 90 bottom
C148  0.1uF  [C0603]  39.63,69.21 90 bottom
C149  0.1uF  [C0603]  46.87,81.79 270 top
C150  10uF  [C0805]  38.48,83.19 180 bottom
C151  0.1uF  [C0603]  38.61,81.28 180 bottom
C152  10uF  [C0805]  44.83,87.88 180 bottom
C153  0.1uF  [C0603]  44.96,85.6 180 bottom
C154  10pF  [C0603]  42.17,67.56 180 top
C155  50pF  [C0603]  46.61,65.41 180 top
C156  10uF  [C0805]  28.96,68.83 90 bottom
C157  0.1uF  [C0603]  30.99,69.34 90 bottom
C158  [C0603]  29.85,77.85 270 top
C159  10uF  [C0805]  26.29,68.83 90 bottom
C160  0.1uF  [C0603]  24.39,69.21 90 bottom
C161  0.1uF  [C0603]  31.63,81.79 270 top
C162  10uF  [C0805]  23.24,83.19 180 bottom
C163  0.1uF  [C0603]  23.37,81.28 180 bottom
C164  10uF  [C0805]  29.59,87.88 180 bottom
C165  0.1uF  [C0603]  29.72,85.6 180 bottom
C166  10pF  [C0603]  26.93,67.56 180 top
C167  50pF  [C0603]  31.37,65.41 180 top
C168  0.1uF  [C0603]  93.86,47.12 180 top
C169  10uF  [C0805]  93.86,45.09 180 top
C170  0.1uF  [C0603]  102.87,54.36 0 top
C171  10uF  [C0805]  103.13,56.39 0 top
ISO1  SI-SI8655  [QSOP-16]  134.38,93 90 top
ISO2  SI-SI8655  [QSOP-16]  134.38,86.63 90 top
ISO3  SI-SI8655  [QSOP-16]  134.38,80.38 90 top
ISO4  SI-SI8655  [QSOP-16]  134.38,74.13 90 top
ISO5  SI-SI8655  [QSOP-16]  134.38,67.88 90 top
ISO6  SI-SI8655  [QSOP-16]  134.38,61.63 90 top
ISO7  SI-SI8655  [QSOP-16]  134.38,55.38 90 top
ISO8  SI-SI8655  [QSOP-16]  134.38,49.13 90 top
ISO9  SI-SI8655  [QSOP-16]  134.38,74.13 90 bottom
ISO10  SI-SI8655  [QSOP-16]  134.38,80.38 90 bottom
ISO11  SI-SI8655  [QSOP-16]  134.38,61.63 270 bottom
J1  EUROCARD-CPCI-220EUROCARD-B19+AB25-NOFRONTDIM  [EUROCARD-CPCI-B19+1B25-NOFRONTDIM]  86,50.13 0 top
JP2  [JP6Q]  117.1,32.51 90 top
JP3  [JP6Q]  125.22,32.51 90 top
R1  [R0603]  146.38,90 270 bottom
R2  [R0603]  139.5,93.63 270 bottom
R3  10k  [R0603]  140.62,95.63 0 top
R4  50Ω  [R0603]  92.71,61.09 180 top
R5  50Ω  [R0603]  92.71,36.96 180 top
R6  1k  [R0805]  149.62,69.38 0 top
R7  2k  [R0805]  149.62,71.5 180 top
U1  TI-SN74GTLP1395  [TSSOP-20]  147.25,92.13 270 top
U2  TI-SN74GTLPH16912  [TSSOP-56]  142.5,80.13 270 top
U3  TI-SN74GTLPH16912  [TSSOP-56]  142.5,60.13 270 top
U4  AD5791BRUZ  [SOP65P640X120-20N]  102.62,25.53 0 top
U5  AD8676ARZ  [SOIC127P600X175-8N]  102.62,15.62 0 top
U6  AD5791BRUZ  [SOP65P640X120-20N]  87.38,25.53 0 top
U7  AD8676ARZ  [SOIC127P600X175-8N]  87.38,15.62 0 top
U8  AD5791BRUZ  [SOP65P640X120-20N]  72.14,25.53 0 top
U9  AD8676ARZ  [SOIC127P600X175-8N]  72.14,15.62 0 top
U10  AD5791BRUZ  [SOP65P640X120-20N]  56.9,25.53 0 top
U11  AD8676ARZ  [SOIC127P600X175-8N]  56.9,15.62 0 top
U12  AD5791BRUZ  [SOP65P640X120-20N]  41.66,25.53 0 top
U13  AD8676ARZ  [SOIC127P600X175-8N]  41.66,15.62 0 top
U14  AD5791BRUZ  [SOP65P640X120-20N]  26.42,25.53 0 top
U15  AD8676ARZ  [SOIC127P600X175-8N]  26.42,15.62 0 top
U16  AD5791BRUZ  [SOP65P640X120-20N]  103.13,72.52 180 top
U17  AD8676ARZ  [SOIC127P600X175-8N]  103.13,82.42 180 top
U18  AD5791BRUZ  [SOP65P640X120-20N]  87.89,72.52 180 top
U19  AD8676ARZ  [SOIC127P600X175-8N]  87.89,82.42 180 top
U20  AD5791BRUZ  [SOP65P640X120-20N]  72.65,72.52 180 top
U21  AD8676ARZ  [SOIC127P600X175-8N]  72.65,82.42 180 top
U22  AD5791BRUZ  [SOP65P640X120-20N]  57.41,72.52 180 top
U23  AD8676ARZ  [SOIC127P600X175-8N]  57.41,82.42 180 top
U24  AD5791BRUZ  [SOP65P640X120-20N]  42.17,72.52 180 top
U25  AD8676ARZ  [SOIC127P600X175-8N]  42.17,82.42 180 top
U26  AD5791BRUZ  [SOP65P640X120-20N]  26.93,72.52 180 top
U27  AD8676ARZ  [SOIC127P600X175-8N]  26.93,82.42 180 top
U28  AD581KH  [TO254P939X470-3P]  124.46,19.18 0 top
U29  ADP3339-3.3  [SOT230P700X180-4N]  139.7,34.42 90 top
U30  AD8620ARZ  [SOIC127P600X175-8N]  97.79,50.93 0 top
U40  TI-SN74GTLPH1655  [TSSOP-64]  142.5,68.13 90 bottom
X1  [F50HP]  12.7,50.93 90 top

## Tracks (layer width: path | path; a pad name or v marks a point on that pad's centre or on a via)
0B0
  Top 0.305: U2.3 142.25,86.13 140.75,87.63 140.75,90.75 138.82,92.69 ISO1.4
0B1
  Top 0.305: U2.5 142.25,85.13 140.12,87.25 140.12,90.5 138.58,92.05 ISO1.3
0B2
  Top 0.305: U2.6 142,84.63 138.41,88.21 ISO2.7
0B3
  Top 0.305: U2.8 142.25,83.63 138.3,87.58 ISO2.6
0B4
  Top 0.305: U2.9 142,83.13 138.18,86.94 ISO2.5
0B5
  Top 0.305: U2.10 141.75,82.63 138.07,86.31 ISO2.4
0B6
  Top 0.305: U2.12 142,81.63 137.95,85.67 ISO2.3
0B7
  Top 0.305: U2.13 141.62,81.13 140.79,81.96 ISO3.7
0B8
  Top 0.305: U2.14 141.12,80.63 140.42,81.33 ISO3.6
0B9
  Top 0.305: U2.15 140.62,80.13 140.06,80.69 ISO3.5
0B10
  Top 0.305: U2.16 140.12,79.63 139.68,80.06 ISO3.4
0B11
  Top 0.305: U2.17 139.62,79.13 139.3,79.42 ISO3.3
0B12
  Top 0.305: ISO4.7 138.71,75.71 141.12,78.13 U2.19
0B13
  Top 0.305: ISO4.6 138.95,75.08 141.5,77.63 U2.20
0B14
  Top 0.305: ISO4.5 139.19,74.44 141.87,77.13 U2.21
0B15
  Top 0.305: ISO4.4 139.43,73.81 141.75,76.13 U2.23
0B16
  Top 0.305: ISO4.3 139.67,73.17 142.12,75.63 U2.24
0B17
  Top 0.305: U2.26 142.25,74.63 140.12,72.5 140.12,70.25 139.34,69.46 ISO5.7
1B0
  Top 0.305: U3.3 141.75,66.13 139.05,68.83 ISO5.6
1B1
  Top 0.305: U3.5 141.87,65.13 138.81,68.19 ISO5.5
1B2
  Top 0.305: U3.6 141.5,64.63 138.57,67.56 ISO5.4
1B3
  Top 0.305: U3.8 141.62,63.63 138.33,66.92 ISO5.3
1B4
  Top 0.305: ISO6.7 141.21,63.21 141.37,63.13 U3.9
1B5
  Top 0.305: ISO6.6 141.7,62.58 141.87,62.63 U3.10
1B6
  Top 0.305: ISO6.5 141.82,61.95 142.12,61.63 U3.12
1B7
  Top 0.305: ISO6.4 141.56,61.31 141.75,61.13 U3.13
1B8
  Top 0.305: ISO6.3 141.42,60.67 141.5,60.63 U3.14
1B9
  Top 0.305: U3.15 141.12,60.13 137.96,56.96 ISO7.7
1B10
  Top 0.305: U3.16 141.37,59.63 138.08,56.33 ISO7.6
1B11
  Top 0.305: U3.17 141.62,59.13 138.19,55.7 ISO7.5
1B12
  Top 0.305: U3.19 141.37,58.13 138.31,55.06 ISO7.4
1B13
  Top 0.305: U3.20 141.62,57.63 138.42,54.42 ISO7.3
1B14
  Top 0.305: U3.21 142.25,57.13 140.37,55.25 140.37,53.13 137.96,50.71 ISO8.7
1B15
  Top 0.305: ISO8.6 138.2,50.08 140.87,52.75 140.87,55 142,56.13 U3.23
1B16
  Top 0.305: ISO8.5 138.44,49.45 141.37,52.38 141.37,54.75 142.25,55.63 U3.24
1B17
  Top 0.305: ISO8.4 139.56,48.81 140,49.25 140.62,49.25 141.87,50.5 141.87,54.38 142.12,54.63 U3.26
2B0-1  (via drill 0.5)
  Top 0.305: v145.75,63 146,62.75 146,61.25 145.37,60.63 145.37,59.38 145.62,59.13 145.62,54.88 142.62,51.88 142.62,50.13 141.12,48.63 140.37,48.63 139.92,48.17 ISO8.3
  Bottom 0.305: U40.6 143.87,63.13 144.25,63.25 145.5,63.25 v145.75,63
2B0-2
  Bottom 0.305: ISO11.7 138.66,60.04 142.25,63.63 U40.7
2B0-3
  Bottom 0.305: U40.9 142.12,64.63 141.37,63.88 141.37,63.63 138.42,60.67 ISO11.6
2B0-4
  Bottom 0.305: ISO11.5 138.31,61.31 140.75,63.75 140.75,64.13 142.25,65.63 U40.11
2B0-5
  Bottom 0.305: ISO11.4 138.19,61.95 140.12,63.88 140.12,64.5 142.25,66.63 U40.13
2B0-7
  Bottom 0.305: U40.16 142.25,68.13 141.75,67.63 141.75,67 139.5,64.75 139.5,64 138.08,62.58 ISO11.3
2B1-0
  Bottom 0.305: ISO9.14 138.08,73.17 138.75,72.5 138.75,71.63 141.75,68.63 U40.17
2B1-1
  Bottom 0.305: ISO9.13 138.19,73.81 139.37,72.63 139.37,71.88 141.62,69.63 U40.19
2B1-2
  Bottom 0.305: ISO9.12 138.31,74.44 140,72.75 140,72.13 142,70.13 U40.20
2B1-3
  Bottom 0.305: U40.22 141.87,71.13 140.62,72.38 140.62,72.88 138.42,75.08 ISO9.11
2B1-4
  Bottom 0.305: U40.23 142.25,71.63 141.25,72.63 141.25,73 138.54,75.71 ISO9.10
2B1-5
  Bottom 0.305: U40.25 142.25,72.63 141.87,73 141.87,73.25 140.75,74.38 140.75,78.63 139.95,79.42 ISO10.14
2B1-6
  Bottom 0.305: U40.27 142.25,73.63 141.37,74.5 141.37,78.88 140.19,80.06 ISO10.13
2B1-7
  Bottom 0.305: U40.29 142.25,74.63 142,74.88 142,79.13 140.43,80.69 ISO10.12
+5V  (14 unrouted)
+PWR  (via drill 0.38)
  other vias: 102.11,57.91 101.09,57.91
  pour Top (isolate 0.406): 99.19,52.32 102.75,52.32 102.87,58.17 100.97,58.17 99.19,56.52
  pour Route14 (isolate 0.406): 109.22,62.36 109.22,56.01 19.05,56.01 19.05,62.36
  pour Route14 (isolate 0.406): 109.22,62.36 114.3,62.36 123.19,53.47 123.19,41.78 125.22,39.75 125.22,25.15 122.81,25.15 122.68,27.81 122.68,39.12 120.65,41.15 120.65,46.36 111,56.01 109.22,56.01
+VPWR  (via drill 0.38)
  Top 0.406: U4.5 97.54,25.86 97.54,25.53 | U6.5 82.3,25.86 82.3,25.53 | U8.5 67.06,25.86 67.06,25.53 | U10.5 51.82,25.86 51.82,25.53 | U12.5 36.58,25.86 36.58,25.53 | U14.5 21.34,25.86 21.34,25.53 | U16.5 108.21,72.19 108.21,72.52 | U18.5 92.97,72.19 92.97,72.52 | U20.5 77.73,72.19 77.73,72.52 | U22.5 62.49,72.19 62.49,72.52 | U24.5 47.25,72.19 47.25,72.52 | U26.5 32.01,72.19 32.01,72.52
  other vias: 105.92,18.8 105.03,18.8 97.67,27.18 97.67,26.29 97.67,25.4 90.68,18.8 89.79,18.8 82.43,27.18 82.43,26.29 82.43,25.4 75.44,18.8 74.55,18.8 67.19,27.18 67.19,26.29 67.19,25.4 60.2,18.8 59.31,18.8 51.95,27.18 51.95,26.29 51.95,25.4 44.96,18.8 44.07,18.8 36.71,27.18 36.71,26.29 36.71,25.4 29.72,18.8 28.83,18.8 21.47,27.18 21.47,26.29 21.47,25.4 99.82,79.25 100.71,79.25 108.08,70.87 108.08,71.75 108.08,72.64 100.71,93.22 99.82,93.22 84.58,79.25 85.47,79.25 92.84,70.87 92.84,71.75 92.84,72.64 85.47,93.34 84.58,93.34 69.34,79.25 70.23,79.25 77.6,70.87 77.6,71.75 77.6,72.64 70.23,93.22 69.34,93.22 54.1,79.25 54.99,79.25 62.36,70.87 62.36,71.75 62.36,72.64 54.99,93.22 54.1,93.22 38.86,79.25 39.75,79.25 47.12,70.87 47.12,71.75 47.12,72.64 39.75,93.34 38.86,93.34 23.62,79.25 24.51,79.25 31.88,70.87 31.88,71.75 31.88,72.64 24.51,93.34 23.62,93.34 28.58,6.1 29.72,6.1 43.94,6.1 45.21,6.1 59.18,6.1 60.45,6.1 74.42,6.1 75.69,6.1 89.66,6.1 90.93,6.1 104.9,6.1 106.17,6.1
  pour Top (isolate 0.305): 98.81,25.91 97.79,27.43 97.16,27.43 97.16,25.15 98.05,25.15
  pour Top (isolate 0.406, no thermals): 104.52,17.4 106.56,17.4 106.56,19.3 104.52,19.3
  pour Bottom (isolate 0.305): 97.16,25.15 97.92,25.15 98.43,25.65 98.43,26.8 101.48,26.8 101.48,28.57 97.16,28.57
  pour Bottom (isolate 0.254): 106.56,18.03 106.56,19.3 103.51,19.43 103.51,13.34 105.92,13.21 105.92,18.03
  pour Bottom (isolate 0.254): 100.59,26.92 100.59,14.99 104.4,11.18 104.4,4.83 106.56,4.83 106.56,10.92 101.86,15.75 101.73,26.92
  pour Top (isolate 0.305): 83.57,25.91 82.55,27.43 81.92,27.43 81.92,25.15 82.81,25.15
  pour Top (isolate 0.406, no thermals): 89.28,17.4 91.32,17.4 91.32,19.3 89.28,19.3
  pour Bottom (isolate 0.305): 81.92,25.15 82.68,25.15 83.19,25.65 83.19,26.8 86.24,26.8 86.24,28.57 81.92,28.57
  pour Bottom (isolate 0.254): 91.32,18.03 91.32,19.3 88.27,19.3 88.27,13.21 90.68,13.21 90.68,18.03
  pour Bottom (isolate 0.254): 85.35,26.92 85.35,14.99 89.16,11.18 89.16,4.83 91.32,4.83 91.32,10.92 86.62,15.75 86.49,26.92
  pour Top (isolate 0.305): 68.33,25.91 67.31,27.43 66.68,27.43 66.68,25.15 67.57,25.15
  pour Top (isolate 0.406, no thermals): 74.04,17.4 76.08,17.4 76.08,19.3 74.04,19.3
  pour Bottom (isolate 0.305): 66.68,25.15 67.44,25.15 67.95,25.65 67.95,26.8 71,26.8 71,28.57 66.68,28.57
  pour Bottom (isolate 0.254): 76.08,18.03 76.08,19.3 73.03,19.3 73.03,13.21 75.44,13.21 75.44,18.03
  pour Bottom (isolate 0.254): 70.11,26.92 70.11,14.99 73.92,11.18 73.92,4.83 76.08,4.83 76.08,10.92 71.38,15.75 71.25,26.92
  pour Top (isolate 0.305): 53.09,25.91 52.07,27.43 51.44,27.43 51.44,25.15 52.33,25.15
  pour Top (isolate 0.406, no thermals): 58.8,17.4 60.84,17.4 60.84,19.3 58.8,19.3
  pour Bottom (isolate 0.305): 51.44,25.15 52.2,25.15 52.71,25.65 52.71,26.8 55.76,26.8 55.76,28.57 51.44,28.57
  pour Bottom (isolate 0.254): 60.84,18.03 60.84,19.3 57.66,19.3 57.66,13.21 60.2,13.21 60.2,18.03
  pour Bottom (isolate 0.254): 54.87,26.92 54.87,14.99 58.68,11.18 58.68,4.83 60.84,4.83 60.84,10.92 56.14,15.75 56.01,26.92
  pour Top (isolate 0.305): 37.85,25.91 36.83,27.43 36.2,27.43 36.2,25.15 37.09,25.15
  pour Top (isolate 0.406, no thermals): 43.56,17.4 45.6,17.4 45.6,19.3 43.56,19.3
  pour Bottom (isolate 0.305): 36.2,25.15 36.96,25.15 37.47,25.65 37.47,26.8 40.52,26.8 40.52,28.57 36.2,28.57
  pour Bottom (isolate 0.254): 45.6,18.03 45.6,19.3 42.55,19.3 42.55,13.21 44.96,13.21 44.96,18.03
  pour Bottom (isolate 0.254): 39.63,27.43 39.63,14.99 43.44,11.18 43.44,4.83 45.6,4.83 45.6,10.92 40.9,15.75 40.77,27.43
  pour Top (isolate 0.305): 22.61,25.91 21.59,27.43 20.96,27.43 20.96,25.15 21.85,25.15
  pour Top (isolate 0.406, no thermals): 28.32,17.4 30.36,17.4 30.36,19.3 28.32,19.3
  pour Bottom (isolate 0.305): 20.96,25.15 21.72,25.15 22.23,25.65 22.23,26.54 25.28,26.54 25.28,28.57 20.96,28.57
  pour Bottom (isolate 0.254): 30.36,18.03 30.36,19.3 27.05,19.3 27.05,13.21 29.72,13.21 29.72,18.03
  pour Bottom (isolate 0.254): 24.39,27.3 24.39,14.99 28.2,11.18 28.2,4.83 30.36,4.83 30.36,10.92 25.66,15.75 25.53,27.3
  pour Top (isolate 0.305): 106.94,72.14 107.95,70.61 108.59,70.61 108.59,72.9 107.7,72.9
  pour Top (isolate 0.406, no thermals): 101.22,80.64 99.19,80.64 99.19,78.74 101.22,78.74
  pour Bottom (isolate 0.305): 108.59,72.9 107.83,72.9 107.32,72.39 107.32,71.25 104.27,71.25 104.27,69.47 108.59,69.47
  pour Bottom (isolate 0.254): 99.19,80.01 99.19,78.74 101.48,78.74 101.48,84.84 99.82,84.84 99.82,80.01
  pour Bottom (isolate 0.254): 105.16,71.12 105.16,83.06 101.35,86.87 101.35,93.85 99.19,93.85 99.19,87.12 103.89,82.3 104.02,71.12
  pour Top (isolate 0.305): 91.7,72.14 92.71,70.61 93.35,70.61 93.35,72.9 92.46,72.9
  pour Top (isolate 0.406, no thermals): 85.98,80.64 83.95,80.64 83.95,78.74 85.98,78.74
  pour Bottom (isolate 0.305): 93.35,72.9 92.59,72.9 92.08,72.39 92.08,71.25 89.03,71.25 89.03,69.47 93.35,69.47
  pour Bottom (isolate 0.254): 83.95,80.01 83.95,78.74 86.24,78.74 86.24,84.84 84.58,84.84 84.58,80.01
  pour Bottom (isolate 0.254): 89.92,71.12 89.92,83.06 86.11,86.87 86.11,93.98 83.95,93.98 83.95,87.12 88.65,82.3 88.78,71.12
  pour Top (isolate 0.305): 76.46,72.14 77.47,70.61 78.11,70.61 78.11,72.9 77.22,72.9
  pour Top (isolate 0.406, no thermals): 70.74,80.64 68.71,80.64 68.71,78.74 70.74,78.74
  pour Bottom (isolate 0.305): 78.11,72.9 77.35,72.9 76.84,72.39 76.84,71.25 73.79,71.25 73.79,69.47 78.11,69.47
  pour Bottom (isolate 0.254): 68.71,80.01 68.71,78.74 71,78.74 71,84.84 69.34,84.84 69.34,80.01
  pour Bottom (isolate 0.254): 74.68,71.12 74.68,83.06 70.87,86.87 70.87,93.73 68.71,93.73 68.71,87.12 73.41,82.3 73.54,71.12
  pour Top (isolate 0.305): 61.22,72.14 62.23,70.61 62.87,70.61 62.87,72.9 61.98,72.9
  pour Top (isolate 0.406, no thermals): 55.5,80.64 53.47,80.64 53.47,78.74 55.5,78.74
  pour Bottom (isolate 0.305): 62.87,72.9 62.11,72.9 61.6,72.39 61.6,71.25 58.55,71.25 58.55,69.47 62.87,69.47
  pour Bottom (isolate 0.254): 53.47,80.01 53.47,78.74 55.76,78.74 55.76,84.84 54.1,84.84 54.1,80.01
  pour Bottom (isolate 0.254): 59.44,71.12 59.44,83.06 55.63,86.87 55.63,93.85 53.47,93.85 53.47,87.12 58.17,82.3 58.3,71.12
  pour Top (isolate 0.305): 45.98,72.14 46.99,70.61 47.63,70.61 47.63,72.9 46.74,72.9
  pour Top (isolate 0.406, no thermals): 40.26,80.64 38.23,80.64 38.23,78.74 40.26,78.74
  pour Bottom (isolate 0.305): 47.63,72.9 46.87,72.9 46.36,72.39 46.36,71.25 43.31,71.25 43.31,69.47 47.63,69.47
  pour Bottom (isolate 0.254): 38.23,80.01 38.23,78.74 40.52,78.74 40.52,84.84 38.86,84.84 38.86,80.01
  pour Bottom (isolate 0.254): 44.2,71.12 44.2,83.06 40.39,86.87 40.39,94.49 38.23,94.49 38.23,87.12 42.93,82.3 43.06,71.12
  pour Top (isolate 0.305): 30.74,72.14 31.75,70.61 32.39,70.61 32.39,72.9 31.5,72.9
  pour Top (isolate 0.406, no thermals): 25.02,80.64 22.99,80.64 22.99,78.74 25.02,78.74
  pour Bottom (isolate 0.305): 32.39,72.9 31.63,72.9 31.12,72.39 31.12,71.25 28.07,71.25 28.07,69.47 32.39,69.47
  pour Bottom (isolate 0.254): 22.99,80.01 22.99,78.74 25.28,78.74 25.28,84.84 23.62,84.84 23.62,80.01
  pour Bottom (isolate 0.254): 28.96,71.12 28.96,83.06 25.15,86.87 25.15,94.11 22.99,94.11 22.99,87.12 27.69,82.3 27.82,71.12
  pour Route15 (isolate 0.254): 12.7,6.48 12.7,-1.14 160.02,-1.14 160.02,28.07 153.67,28.07 132.08,6.48
  pour Route15 (isolate 0.254): 13.97,103 132.46,103 132.46,46.74 135.89,43.31 167.64,43.31 167.64,20.45 147.32,20.45 124.46,43.31 124.46,92.84 13.97,92.84
-PWR  (via drill 0.38)
  other vias: 96.01,43.69 95,43.69
  pour Top (isolate 0.406): 93.86,49.15 97.03,49.15 97.03,43.43 93.86,43.43
  pour Route14 (isolate 0.406): 109.22,44.58 109.22,38.23 19.05,38.23 19.05,44.58
  pour Route14 (isolate 0.406): 109.22,44.58 113.03,44.58 117.1,40.51 117.1,25.53 114.3,25.53 114.3,35.69 111.76,38.23 109.22,38.23
-VPWR  (via drill 0.38)
  Top 0.406: U4.18 107.22,27.15 v107.7,26.54 | U6.18 91.98,27.15 v92.46,26.54 | U8.18 76.74,27.15 v77.22,26.54 | U10.18 61.5,27.15 v61.98,26.54 | U12.18 46.26,27.15 v46.74,26.54 | U14.18 31.02,27.15 v31.5,26.54 | U16.18 98.53,70.89 v98.05,71.5 | U18.18 83.29,70.89 v82.81,71.5 | U20.18 68.05,70.89 v67.57,71.5 | U22.18 52.81,70.89 v52.33,71.5 | U24.18 37.57,70.89 v37.09,71.5 | U26.18 22.33,70.89 v21.85,71.5
  other vias: 107.7,27.43 97.79,13.72 97.79,12.83 98.68,13.72 107.7,28.32 102.62,26.92 103.51,26.92 92.46,27.43 82.55,13.72 82.55,12.83 83.44,13.72 92.46,28.32 87.38,26.92 88.27,26.92 77.22,27.43 67.31,13.72 67.31,12.83 68.2,13.72 77.22,28.32 72.14,26.92 73.03,26.92 61.98,27.43 52.07,13.72 52.07,12.83 52.96,13.72 61.98,28.32 56.9,26.92 57.79,26.92 46.74,27.43 36.83,13.72 36.83,12.83 37.72,13.72 46.74,28.32 41.66,26.92 42.55,26.92 31.5,27.43 21.59,13.72 21.59,12.83 22.48,13.72 31.5,28.32 26.42,26.92 27.31,26.92 98.05,70.61 107.95,84.33 107.95,85.22 107.06,84.33 98.05,69.72 103.13,71.12 102.24,71.12 82.81,70.61 92.71,84.33 92.71,85.22 91.82,84.33 82.81,69.72 87.89,71.12 87,71.12 67.57,70.61 77.47,84.33 77.47,85.22 76.58,84.33 67.57,69.72 72.65,71.12 71.76,71.12 52.33,70.61 62.23,84.33 62.23,85.22 61.34,84.33 52.33,69.72 57.41,71.12 56.52,71.12 37.09,70.61 46.99,84.33 46.99,85.22 46.1,84.33 37.09,69.72 42.17,71.12 41.28,71.12 21.85,70.61 31.75,84.33 31.75,85.22 30.86,84.33 21.85,69.72 26.93,71.12 26.04,71.12 21.59,7.75 22.86,7.75 22.23,8.51 31.75,90.3 30.48,90.3 31.12,89.53 46.99,90.3 45.72,90.3 46.36,89.53 62.23,90.3 60.96,90.3 61.6,89.53 77.47,90.3 76.2,90.3 76.84,89.53 92.71,90.3 91.44,90.3 92.08,89.53 36.83,7.75 38.1,7.75 37.47,8.51 52.07,7.75 53.34,7.75 52.71,8.51 67.31,7.75 68.58,7.75 67.95,8.51 82.55,7.75 83.82,7.75 83.19,8.51 97.79,7.75 99.06,7.75 98.43,8.51 107.95,90.3 106.68,90.3 107.32,89.53
  pour Top (isolate 0.305): 106.3,27.18 107.06,26.29 108.08,26.29 108.08,28.7 107.06,28.7
  pour Bottom (isolate 0.254): 97.28,14.1 97.28,8.89 99.7,8.89 99.7,14.1
  pour Top (isolate 0.254): 97.16,14.1 97.16,12.32 100.71,12.32 100.71,14.1
  pour Bottom (isolate 0.305): 102.49,28.7 102.49,26.29 108.08,26.29 108.08,28.7
  pour Route14: 102.11,27.56 102.11,12.95 102.87,12.19 102.87,4.95 104.52,4.95 104.52,12.45 103.89,13.08 103.89,27.56
  pour Top (isolate 0.305): 91.06,27.18 91.82,26.29 92.84,26.29 92.84,28.7 91.82,28.7
  pour Bottom (isolate 0.254): 82.04,14.1 82.04,8.89 84.46,8.89 84.46,14.1
  pour Top (isolate 0.254): 81.92,14.1 81.92,12.32 85.47,12.32 85.47,14.1
  pour Bottom (isolate 0.305): 87.25,28.7 87.25,26.29 92.84,26.29 92.84,28.7
  pour Route14: 86.87,27.56 86.87,12.95 87.63,12.19 87.63,4.95 89.28,4.95 89.28,12.45 88.65,13.08 88.65,27.56
  pour Top (isolate 0.305): 75.82,27.18 76.58,26.29 77.6,26.29 77.6,28.7 76.58,28.7
  pour Bottom (isolate 0.254): 66.8,14.1 66.8,8.89 69.22,8.89 69.22,14.1
  pour Top (isolate 0.254): 66.68,14.1 66.68,12.32 70.23,12.32 70.23,14.1
  pour Bottom (isolate 0.305): 72.01,28.7 72.01,26.29 77.6,26.29 77.6,28.7
  pour Route14: 71.63,27.56 71.63,12.95 72.39,12.19 72.39,4.95 74.04,4.95 74.04,12.45 73.41,13.08 73.41,27.56
  pour Top (isolate 0.305): 60.58,27.18 61.34,26.29 62.36,26.29 62.36,28.7 61.34,28.7
  pour Bottom (isolate 0.254): 51.56,14.1 51.56,8.89 53.98,8.89 53.98,14.1
  pour Top (isolate 0.254): 51.44,14.1 51.44,12.32 54.99,12.32 54.99,14.1
  pour Bottom (isolate 0.305): 56.77,28.7 56.77,26.29 62.36,26.29 62.36,28.7
  pour Route14: 56.39,27.56 56.39,12.95 57.15,12.19 57.15,4.95 58.8,4.95 58.8,12.45 58.17,13.08 58.17,27.56
  pour Top (isolate 0.305): 45.34,27.18 46.1,26.29 47.12,26.29 47.12,28.7 46.1,28.7
  pour Bottom (isolate 0.254): 36.32,14.1 36.32,8.89 38.74,8.89 38.74,14.1
  pour Top (isolate 0.254): 36.2,14.1 36.2,12.32 39.75,12.32 39.75,14.1
  pour Bottom (isolate 0.305): 41.53,28.7 41.53,26.29 47.12,26.29 47.12,28.7
  pour Route14: 41.15,27.56 41.15,12.95 41.91,12.19 41.91,4.95 43.56,4.95 43.56,12.45 42.93,13.08 42.93,27.56
  pour Top (isolate 0.305): 30.1,27.18 30.86,26.29 31.88,26.29 31.88,28.7 30.86,28.7
  pour Bottom (isolate 0.254): 21.08,14.1 21.08,7.62 23.5,7.62 23.5,14.1
  pour Top (isolate 0.254): 20.96,14.1 20.96,12.32 24.51,12.32 24.51,14.1
  pour Bottom (isolate 0.305): 26.29,28.7 26.29,26.29 31.88,26.29 31.88,28.7
  pour Route14: 25.91,27.56 25.91,12.95 26.67,12.19 26.67,4.95 28.32,4.95 28.32,12.45 27.69,13.08 27.69,27.56
  pour Top (isolate 0.305): 99.44,70.87 98.68,71.75 97.67,71.75 97.67,69.34 98.68,69.34
  pour Bottom (isolate 0.254): 108.46,83.95 108.46,89.15 106.05,89.15 106.05,83.95
  pour Top (isolate 0.254): 108.59,83.95 108.59,85.72 105.03,85.72 105.03,83.95
  pour Bottom (isolate 0.305): 103.25,69.34 103.25,71.75 97.67,71.75 97.67,69.34
  pour Route14: 103.63,70.48 103.63,85.09 102.87,85.85 102.87,94.36 101.22,94.36 101.22,85.6 101.86,84.96 101.86,70.48
  pour Top (isolate 0.305): 84.2,70.87 83.44,71.75 82.43,71.75 82.43,69.34 83.44,69.34
  pour Bottom (isolate 0.254): 93.22,83.95 93.22,89.15 90.81,89.15 90.81,83.95
  pour Top (isolate 0.254): 93.35,83.95 93.35,85.72 89.79,85.72 89.79,83.95
  pour Bottom (isolate 0.305): 88.01,69.34 88.01,71.75 82.43,71.75 82.43,69.34
  pour Route14: 88.39,70.48 88.39,85.09 87.63,85.85 87.63,94.36 85.98,94.36 85.98,85.6 86.62,84.96 86.62,70.48
  pour Top (isolate 0.305): 68.96,70.87 68.2,71.75 67.19,71.75 67.19,69.34 68.2,69.34
  pour Bottom (isolate 0.254): 77.98,83.95 77.98,89.15 75.57,89.15 75.57,83.95
  pour Top (isolate 0.254): 78.11,83.95 78.11,85.72 74.55,85.72 74.55,83.95
  pour Bottom (isolate 0.305): 72.77,69.34 72.77,71.75 67.19,71.75 67.19,69.34
  pour Route14: 73.15,70.48 73.15,85.09 72.39,85.85 72.39,94.36 70.74,94.36 70.74,85.6 71.38,84.96 71.38,70.48
  pour Top (isolate 0.305): 53.72,70.87 52.96,71.75 51.95,71.75 51.95,69.34 52.96,69.34
  pour Bottom (isolate 0.254): 62.74,83.95 62.74,89.15 60.33,89.15 60.33,83.95
  pour Top (isolate 0.254): 62.87,83.95 62.87,85.72 59.31,85.72 59.31,83.95
  pour Bottom (isolate 0.305): 57.53,69.34 57.53,71.75 51.95,71.75 51.95,69.34
  pour Route14: 57.91,70.48 57.91,85.09 57.15,85.85 57.15,94.36 55.5,94.36 55.5,85.6 56.14,84.96 56.14,70.48
  pour Top (isolate 0.305): 38.48,70.87 37.72,71.75 36.71,71.75 36.71,69.34 37.72,69.34
  pour Bottom (isolate 0.254): 47.5,83.95 47.5,89.15 45.09,89.15 45.09,83.95
  pour Top (isolate 0.254): 47.63,83.95 47.63,85.72 44.07,85.72 44.07,83.95
  pour Bottom (isolate 0.305): 42.29,69.34 42.29,71.75 36.71,71.75 36.71,69.34
  pour Route14: 42.67,70.48 42.67,85.09 41.91,85.85 41.91,94.36 40.26,94.36 40.26,85.6 40.9,84.96 40.9,70.48
  pour Top (isolate 0.305): 23.24,70.87 22.48,71.75 21.47,71.75 21.47,69.34 22.48,69.34
  pour Bottom (isolate 0.254): 32.26,83.95 32.26,89.15 29.85,89.15 29.85,83.95
  pour Top (isolate 0.254): 32.39,83.95 32.39,85.72 28.83,85.72 28.83,83.95
  pour Bottom (isolate 0.305): 27.05,69.34 27.05,71.75 21.47,71.75 21.47,69.34
  pour Route14: 27.43,70.48 27.43,85.09 26.67,85.85 26.67,94.36 25.02,94.36 25.02,85.6 25.66,84.96 25.66,70.48
  pour Route14 (isolate 0.254): 12.7,6.48 12.7,-1.14 167.64,-1.14 167.64,28.07 153.67,28.07 133.35,7.75 132.08,6.48
  pour Route14 (isolate 0.305): 21.08,8.76 21.08,5.33 23.5,5.33 23.5,8.76
  pour Route14 (isolate 0.254): 13.97,103 132.46,103 132.46,46.74 135.89,43.31 167.64,43.31 167.64,20.45 147.32,20.45 124.46,43.31 124.46,92.84 13.97,92.84
  pour Route14 (isolate 0.305): 32.26,89.28 32.26,93.98 29.85,93.98 29.85,89.28
  pour Bottom (isolate 0.254): 32.26,83.95 32.26,90.42 29.85,90.42 29.85,83.95
  pour Route14 (isolate 0.305): 47.5,89.28 47.5,93.98 45.09,93.98 45.09,89.28
  pour Bottom (isolate 0.254): 47.5,83.95 47.5,90.42 45.09,90.42 45.09,83.95
  pour Bottom (isolate 0.254): 47.5,83.95 47.5,89.15 45.09,89.15 45.09,83.95
  pour Bottom (isolate 0.254): 62.74,83.95 62.74,90.42 60.33,90.42 60.33,83.95
  pour Route14 (isolate 0.305): 62.74,89.28 62.74,93.98 60.33,93.98 60.33,89.28
  pour Bottom (isolate 0.254): 77.98,83.95 77.98,90.42 75.57,90.42 75.57,83.95
  pour Route14 (isolate 0.305): 77.98,89.28 77.98,93.98 75.57,93.98 75.57,89.28
  pour Bottom (isolate 0.254): 93.22,83.95 93.22,90.42 90.81,90.42 90.81,83.95
  pour Route14 (isolate 0.305): 93.22,89.28 93.22,93.98 90.81,93.98 90.81,89.28
  pour Bottom (isolate 0.254): 108.46,83.95 108.46,90.42 106.05,90.42 106.05,83.95
  pour Route14 (isolate 0.305): 108.46,89.28 108.46,93.98 106.05,93.98 106.05,89.28
  pour Route14 (isolate 0.305): 36.32,8.76 36.32,5.33 38.74,5.33 38.74,8.76
  pour Bottom (isolate 0.254): 36.32,14.1 36.32,7.62 38.74,7.62 38.74,14.1
  pour Route14 (isolate 0.305): 51.56,8.76 51.56,5.33 53.98,5.33 53.98,8.76
  pour Bottom (isolate 0.254): 51.56,14.1 51.56,7.62 53.98,7.62 53.98,14.1
  pour Bottom (isolate 0.254): 66.8,14.1 66.8,7.62 69.22,7.62 69.22,14.1
  pour Route14 (isolate 0.305): 66.8,8.76 66.8,5.33 69.22,5.33 69.22,8.76
  pour Bottom (isolate 0.254): 82.04,14.1 82.04,7.62 84.46,7.62 84.46,14.1
  pour Route14 (isolate 0.305): 82.04,8.76 82.04,5.33 84.46,5.33 84.46,8.76
  pour Bottom (isolate 0.254): 97.28,14.1 97.28,7.62 99.7,7.62 99.7,14.1
  pour Route14 (isolate 0.305): 97.28,8.76 97.28,5.33 99.7,5.33 99.7,8.76
-VPWR9
  pour Bottom (isolate 0.254): 62.74,83.95 62.74,89.15 60.33,89.15 60.33,83.95
-VPWR11
  pour Bottom (isolate 0.254): 77.98,83.95 77.98,89.15 75.57,89.15 75.57,83.95
-VPWR13
  pour Bottom (isolate 0.254): 93.22,83.95 93.22,89.15 90.81,89.15 90.81,83.95
-VPWR15
  pour Bottom (isolate 0.254): 108.46,83.95 108.46,89.15 106.05,89.15 106.05,83.95
AGND  (58 unrouted)
ANALOG_REF  (via drill 0.38)
  Top 0.61: U5.3 97.92,14.99 C29.1 | U7.3 82.68,14.99 C41.1 | U9.3 67.44,14.99 C53.1 | U11.3 52.2,14.99 C65.1 | U13.3 36.96,14.99 C77.1 | U15.3 21.72,14.99 C89.1 | U17.3 107.83,83.06 C101.1 | U19.3 92.59,83.06 C113.1 | U21.3 77.35,83.06 C125.1 | U23.3 62.11,83.06 C137.1 | U25.3 46.87,83.06 C149.1 | U27.3 31.63,83.06 C161.1
  Top 0.813: U15.3 19.94,14.99 19.05,14.1 | U13.3 35.18,14.99 34.29,14.1 | U11.3 50.42,14.99 49.53,14.1 | U9.3 65.66,14.99 64.77,14.1 | U7.3 80.9,14.99 80.01,14.1 | U5.3 96.14,14.99 95.25,14.1 | U27.3 33.4,83.06 34.29,83.95 | U17.3 109.6,83.06 110.49,83.95 | U19.3 94.36,83.06 95.25,83.95 | U21.3 79.12,83.06 80.01,83.95 | U23.3 63.88,83.06 64.77,83.95 | U25.3 48.64,83.06 49.53,83.95
  other vias: 18.42,14.99 19.56,14.99 19.56,13.72 18.42,13.72 33.66,14.99 34.8,14.99 34.8,13.72 33.66,13.72 48.9,14.99 50.04,14.99 50.04,13.72 48.9,13.72 64.14,14.99 65.28,14.99 65.28,13.72 64.14,13.72 79.38,14.99 80.52,14.99 80.52,13.72 79.38,13.72 94.62,14.99 95.76,14.99 95.76,13.72 94.62,13.72 34.93,83.06 33.78,83.06 33.78,84.33 34.93,84.33 111.13,83.06 109.98,83.06 109.98,84.33 111.13,84.33 95.89,83.06 94.74,83.06 94.74,84.33 95.89,84.33 80.65,83.06 79.5,83.06 79.5,84.33 80.65,84.33 65.41,83.06 64.26,83.06 64.26,84.33 65.41,84.33 50.17,83.06 49.02,83.06 49.02,84.33 50.17,84.33
  pour Route3 (isolate 0.305): 115.57,20.45 130.81,20.45 130.81,-4.95 -3.81,-4.95 -3.81,101.73 116.84,101.73 116.84,95.38 7.62,95.38 7.62,3.94 115.57,3.94
  pour Top (isolate 0.305): 18.16,14.73 18.16,15.24 19.81,15.24 19.81,13.46 18.16,13.46
  pour Route3 (isolate 0.305): 18.16,15.24 19.94,15.24 19.94,2.67 18.16,2.67
  pour Top (isolate 0.305): 33.4,14.73 33.4,15.24 35.05,15.24 35.05,13.46 33.4,13.46
  pour Route3 (isolate 0.305): 33.4,15.24 35.18,15.24 35.18,2.67 33.4,2.67
  pour Top (isolate 0.305): 48.64,14.73 48.64,15.24 50.29,15.24 50.29,13.46 48.64,13.46
  pour Route3 (isolate 0.305): 48.64,15.24 50.42,15.24 50.42,2.67 48.64,2.67
  pour Top (isolate 0.305): 63.88,14.73 63.88,15.24 65.53,15.24 65.53,13.46 63.88,13.46
  pour Route3 (isolate 0.305): 63.88,15.24 65.66,15.24 65.66,2.67 63.88,2.67
  pour Top (isolate 0.305): 79.12,14.73 79.12,15.24 80.77,15.24 80.77,13.46 79.12,13.46
  pour Route3 (isolate 0.305): 79.12,15.24 80.9,15.24 80.9,2.67 79.12,2.67
  pour Top (isolate 0.305): 94.36,14.73 94.36,15.24 96.01,15.24 96.01,13.46 94.36,13.46
  pour Route3 (isolate 0.305): 94.36,15.24 96.14,15.24 96.14,2.67 94.36,2.67
  pour Top (isolate 0.305): 35.18,83.31 35.18,82.8 33.53,82.8 33.53,84.58 35.18,84.58
  pour Route3 (isolate 0.305): 35.18,82.8 33.4,82.8 33.4,96.65 35.18,96.65
  pour Top (isolate 0.305): 111.38,83.31 111.38,82.8 109.73,82.8 109.73,84.58 111.38,84.58
  pour Route3 (isolate 0.305): 111.38,82.8 109.6,82.8 109.6,96.65 111.38,96.65
  pour Top (isolate 0.305): 96.14,83.31 96.14,82.8 94.49,82.8 94.49,84.58 96.14,84.58
  pour Route3 (isolate 0.305): 96.14,82.8 94.36,82.8 94.36,96.65 96.14,96.65
  pour Top (isolate 0.305): 80.9,83.31 80.9,82.8 79.25,82.8 79.25,84.58 80.9,84.58
  pour Route3 (isolate 0.305): 80.9,82.8 79.12,82.8 79.12,96.65 80.9,96.65
  pour Top (isolate 0.305): 65.66,83.31 65.66,82.8 64.01,82.8 64.01,84.58 65.66,84.58
  pour Route3 (isolate 0.305): 65.66,82.8 63.88,82.8 63.88,96.65 65.66,96.65
  pour Top (isolate 0.305): 50.42,83.31 50.42,82.8 48.77,82.8 48.77,84.58 50.42,84.58
  pour Route3 (isolate 0.305): 50.42,82.8 48.64,82.8 48.64,96.65 50.42,96.65
DACO_1
  Top 0.305: U4.2 98.94,27.81 98.68,28.07 98.68,32.51 C35.2 101.6,35.22 101.6,48.39 100.97,49.02 U30.5
DACO_7
  Top 0.305: U16.2 106.81,70.23 107.06,69.98 107.06,65.53 C107.2 106.72,65.06 98.43,56.77 98.43,52.45 96.27,50.29 U30.3
DGND  (via drill 0.4)
  Top 0.254: 150.16,71.54 R7.1 | U40.61 148.37,62.13 | ISO1.2 138.21,91.41 138.25,91.38 | ISO6.8 137.85,63.85 138.12,64.13 | ISO2.2 137.84,85.04 138.5,84.38 v138.5,82.88
  Top 0.305: U2.11 144.12,82.13 v145.25,81 | U2.4 143.87,85.63 v144.5,86.25 | U2.18 143.65,78.63 144.37,79.35 | U2.46 149.37,82.13 | U2.39 148.87,78.63 | U2.25 v144.62,75.13 | v148.5,76.13 149.5,75.13 U2.32 | U3.11 145.12,62.13 | U3.39 148.37,58.63 | U3.25 v144.75,55.13 | U3.32 148.37,55.13 v148.12,54.88 | U3.4 v144.12,65.63 | U3.53 v148.87,65.63 | U3.55 149.62,66.63 | 149.62,66.63 149.37,66.63 | U3.56 150.12,67.13 149.62,66.63 | U3.18 144.12,58.63 | U2.53 149.37,85.63 v148.87,85.13 | U3.29 150.62,53.63 v151.25,53 | 138,47.5 140.35,47.5 C22.2
  Top 0.406: ISO4.2 137.94,72.54 | ISO5.2 137.96,66.29 | ISO5.8 139.1,70.1 138.25,70.13 | ISO7.8 137.72,57.6 138.5,58.38 | ISO6.2 138.34,60.04 138.5,59.88 | ISO7.2 138.34,53.79 v138.62,53.5 | ISO8.8 137.72,51.35 138.62,52.25 | ISO8.2 137.96,47.54 138,47.5 | ISO10.15 138.34,78.79 v138.5,78.63 | U1.17 149.02,93.1 | U1.13 151.75,90.5 v152.37,89.88 | U1.8 145.5,90.5 146,91 v146,92 | U1.4 145.97,93.1 v146,92.75 | U1.15 149.17,91.8
  Bottom 0.254: U40.26 143.87,73.13 | U40.24 143.75,72.13 | U40.60 149.12,62.63
  Bottom 0.305: U2.25 144.37,75.13 | U40.18 143.62,69.13 144.12,69.63 v144.12,72.5 | U40.21 143.87,70.63 | U40.39 149.25,73.13 | U40.44 149.12,70.63 | U40.47 149.12,69.13 | U40.2 142.25,61.13 141.87,61.5 141.87,62.25 142.25,62.63 U40.5 | U40.5 144,62.63 | U40.5 144.62,62.63 v145.25,61.88 145.75,61.5 148.87,61.5 149.25,61.13 | U40.10 143.75,65.13 | U40.57 149.37,64.13 | U40.53 149.37,66.13 | U40.64 149.75,60.63 149.25,61.13 | U40.63 149.25,61.13 | U40.8 143.62,64.13 144.25,64.75 144.25,65.5 v144.12,65.63 143.62,66.13 U40.12 | 138.5,63.75 138.5,66.15 C16.2
  Bottom 0.406: 149.25,73.13 v149,73.13 | ISO11.8 138.47,59.41 v138.62,58.75 | ISO4.8 138.22,76.35 | ISO10.9 139.1,82.6 v139.25,82.88 | ISO10.15 138.34,78.79 v138.5,78.63 | ISO11.2 137.96,63.21 138.5,63.75
  Bottom 0.813: C25.2 148.97,86.98 148.87,86.88 v148.87,85.13
  other vias: 144.5,81 145.25,86.25 148.12,79.75 148.88,79.75 145.38,75.13 144.12,73.25 148.88,85.88 144.75,62.38 147.88,59.38 144,58.63 144.75,58.63 148.62,59.38 144,55.13 148.88,54.88 144.88,65.63 148.12,65.63 148.88,62.88 147.25,70.25 147.25,69.5 138.5,89.13 139.25,89.13 138.12,96 138.62,95.5 138.62,65 138.62,64.25 138.38,70.88 138.88,70.38 139.12,59.25 139.5,53.5 138.5,76.63 148.12,62.88 148.5,92.25 151.62,89.88 148.12,73.13 147.75,92.25 140.75,47.63 141.5,47.63
  pour Route2 (isolate 0.254): 136,99.63 136,44.25 165.5,44.25 165.5,99.63
  pour Top (isolate 0.254, no thermals): 142.62,82.13 142.62,82 143.62,82 144.12,81.5 144.12,79.25 143.62,78.75 142.62,78.75 142.62,78.63 143.75,78.63 145.62,80.5 145.62,81.13 144.62,82.13
  pour Bottom (isolate 0.254, no thermals): 144.12,81.5 144.12,80.38 144.5,80 145.25,80 145.62,80.38 145.62,81.5 145.25,81.88 144.5,81.88
  pour Top (isolate 0.254, no thermals): 143.62,85.63 143.88,85.63 144.12,85.88 145.38,85.88 145.62,86.13 145.62,86.38 145.38,86.63 144.38,86.63 144.12,86.38 144.12,86.13
  pour Top (isolate 0.254, no thermals): 150.25,85.5 149.38,85.5 149.25,85.38 149.25,85.13 149,84.88 148.75,84.88 148.62,85 148.62,86.63 149.12,87.13 150.38,87.13 150.38,86.63 149.5,86.63 149.25,86.38 149.25,85.88 149.38,85.75 150.25,85.75 150.5,85.63
  pour Bottom (isolate 0.254, rank 2, no thermals): 147.75,79.88 149.38,81.5 149.38,82 150.12,82 150.12,80.88 149.25,80 149.25,79.38 150.38,78.25 150.38,75.63 149.88,75.63 149.88,77.13 148.88,78.13 148.88,78.75 148.25,79.38 148,79.38 147.75,79.63
  pour Top (isolate 0.254, no thermals): 149.62,82.13 149.25,81.75 149.25,79 149.62,78.63 148.75,78.63 147.88,79.5 147.88,80.75 149.25,82.13
  pour Top (isolate 0.254, no thermals): 141.62,70.88 142.88,70.88 143.38,70.38 143.38,69 144.12,69 144.12,72 144.5,72.38 144.5,73.38 144.25,73.63 143.62,73.63 143.25,74 143.25,74.13 142.62,74.13 142.62,72.63 141.62,71.63
  pour Bottom (isolate 0.254, no thermals): 144.25,75.13 144.5,74.88 145.5,74.88 145.62,75 145.62,75.25 145.5,75.38 144.5,75.38
  pour Top (isolate 0.254, no thermals): 145.5,74.88 144.5,74.88 144.25,75.13 144.5,75.38 145.5,75.38 145.62,75.25 145.62,75
  pour Bottom (isolate 0.254, no thermals): 143.88,69.13 143.38,69.13 143.62,69.38 143.62,70.38 143.38,70.63 143.62,70.88 143.62,71.88 143.38,72.13 143.62,72.38 143.62,72.88 143.38,73.13 143.88,73.63 144.25,73.63 144.5,73.38 144.5,69.75
  pour Top (isolate 0.254, no thermals): 147.75,73.25 147.75,73 148,72.75 149.5,72.75 150.12,72.13 150.12,71 151,71 151,72.25 150.5,72.75 150.5,73.63 149.75,73.63 149.62,73.5 148,73.5
  pour Bottom (isolate 0.254, no thermals): 146.88,69.38 146.88,70.38 147.12,70.63 149.62,70.63 149.38,70.38 149.38,69.38 149.62,69.13 147.12,69.13
  pour Bottom (isolate 0.254, no thermals): 145,62.63 146.12,61.5 145.25,61.5 144.12,62.63
  pour Top (isolate 0.254, no thermals): 145.5,62 144.88,62.63 144.62,62.63 144.12,62.13 144.62,62.13 145.12,61.63 145.38,61.63 145.5,61.75
  pour Top (isolate 0.254, no thermals): 143.88,58.38 144.88,58.38 145,58.5 145,58.75 144.88,58.88 143.88,58.88 143.62,58.63
  pour Top (isolate 0.254, rank 2, no thermals): 147.5,59.25 148.12,58.63 149.5,58.63 148.88,59.25 148.88,59.5 148.62,59.75 147.75,59.75 147.5,59.5
  pour Top (isolate 0.254, no thermals): 143.5,55.13 143.88,55.5 144.75,55.5 145,55.25 145,55 143.62,53.63 142.75,53.63 142.75,54.13 143.5,54.13 143.75,54.38 143.75,54.88
  pour Top (isolate 0.254, no thermals): 147.75,55 147.75,54.75 148,54.5 149,54.5 149.62,55.13 149.12,55.13 149,55.25 148,55.25
  pour Bottom (isolate 0.254, no thermals): 148,54.5 149,54.5 149.25,54.75 149.25,55.25 149.62,55.63 149.62,56.13 147.38,56.13 147.38,55.63 147.75,55.25 147.75,54.75
  pour Bottom (isolate 0.254, rank 2, no thermals): 149.25,58.13 147.25,58.13 147.25,59.25 147.75,59.75 148.62,59.75 149.25,59.13
  pour Bottom (isolate 0.254, no thermals): 143.62,64.13 142.62,64.13 142.88,64.25 143.62,64.25 143.75,64.38 143.75,64.88 143.5,65.13 143.75,65.38 143.75,65.88 143.5,66.13 144.88,66.13 145.25,65.75 145.25,65.5 145,65.25 144.75,65.25
  pour Top (isolate 0.254, no thermals): 145.25,65.75 145.25,65.5 145,65.25 144,65.25 143.62,65.63 144,66 145,66